# EAGLE design au-ar (EAGLE 9.5.1)

## Sheet 1 of 6: Au Connectors
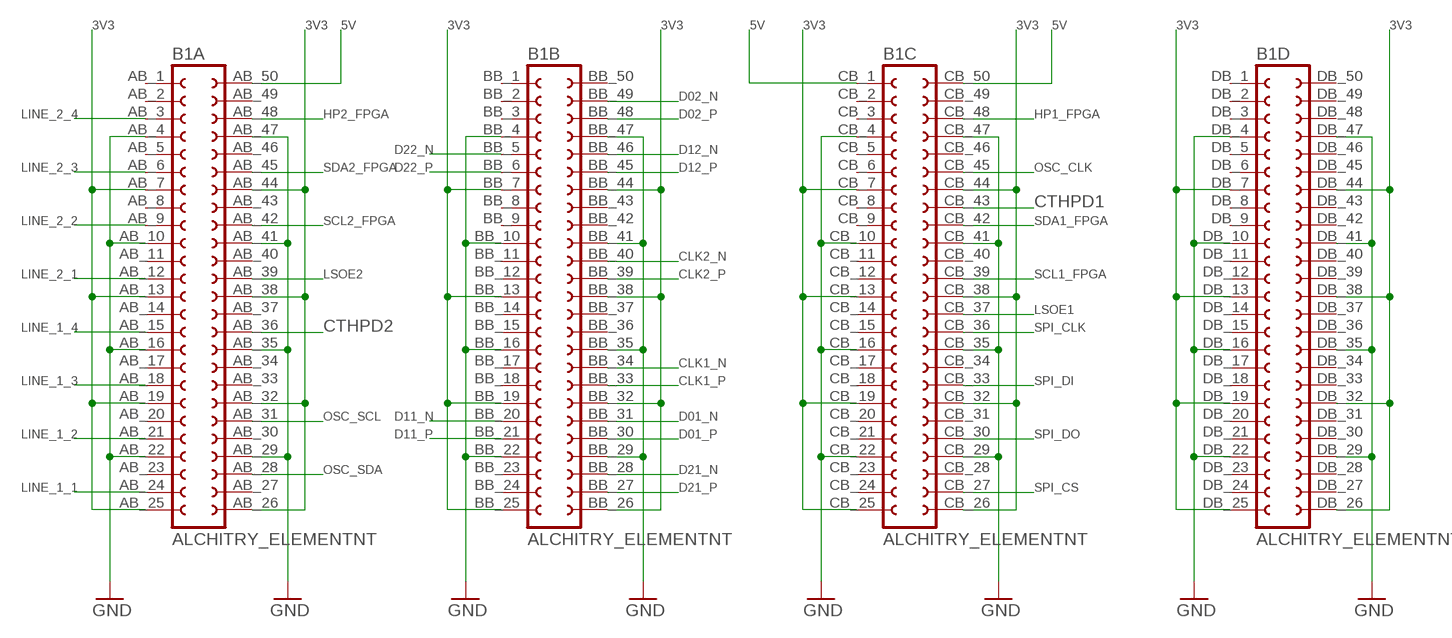
[diagram p0: schematic, sheet 1]

### Parts
B1  ALCHITRY_ELEMENTNT  [ELEMENT_NO_TOP]

### Nets
3V3: B1.AB_7 B1.AB_13 B1.AB_19 B1.AB_25 B1.AB_26 B1.AB_32 B1.AB_38 B1.AB_44 B1.BB_7 B1.BB_13 B1.BB_19 B1.BB_25 B1.BB_26 B1.BB_32 B1.BB_38 B1.BB_44 B1.CB_7 B1.CB_13 B1.CB_19 B1.CB_25 B1.CB_26 B1.CB_32 B1.CB_38 B1.CB_44 B1.DB_7 B1.DB_13 B1.DB_19 B1.DB_25 B1.DB_26 B1.DB_32 B1.DB_38 B1.DB_44 ; also sheet 3,4,5,6
5V: B1.AB_50 B1.CB_1 B1.CB_50 ; also sheet 3
CLK1_N [diff]: B1.BB_34 ; also sheet 2,3
CLK1_P [diff]: B1.BB_33 ; also sheet 2,3
CLK2_N [diff]: B1.BB_40 ; also sheet 2,3
CLK2_P [diff]: B1.BB_39 ; also sheet 2,3
CTHPD1: B1.CB_43 ; also sheet 3
CTHPD2: B1.AB_36 ; also sheet 3
D01_N [diff]: B1.BB_31 ; also sheet 2,3
D01_P [diff]: B1.BB_30 ; also sheet 2,3
D02_N [diff]: B1.BB_49 ; also sheet 2,3
D02_P [diff]: B1.BB_48 ; also sheet 2,3
D11_N [diff]: B1.BB_20 ; also sheet 2,3
D11_P [diff]: B1.BB_21 ; also sheet 2,3
D12_N [diff]: B1.BB_46 ; also sheet 2,3
D12_P [diff]: B1.BB_45 ; also sheet 2,3
D21_N [diff]: B1.BB_28 ; also sheet 2,3
D21_P [diff]: B1.BB_27 ; also sheet 2,3
D22_N [diff]: B1.BB_5 ; also sheet 2,3
D22_P [diff]: B1.BB_6 ; also sheet 2,3
GND: B1.AB_4 B1.AB_10 B1.AB_16 B1.AB_22 B1.AB_29 B1.AB_35 B1.AB_41 B1.AB_47 B1.BB_4 B1.BB_10 B1.BB_16 B1.BB_22 B1.BB_29 B1.BB_35 B1.BB_41 B1.BB_47 B1.CB_4 B1.CB_10 B1.CB_16 B1.CB_22 B1.CB_29 B1.CB_35 B1.CB_41 B1.CB_47 B1.DB_4 B1.DB_10 B1.DB_16 B1.DB_22 B1.DB_29 B1.DB_35 B1.DB_41 B1.DB_47 ; also sheet 2,3,4,5,6
HP1_FPGA: B1.CB_48 ; also sheet 3
HP2_FPGA: B1.AB_48 ; also sheet 3
LINE_1_1: B1.AB_24 ; also sheet 4
LINE_1_2: B1.AB_21 ; also sheet 4
LINE_1_3: B1.AB_18 ; also sheet 4
LINE_1_4: B1.AB_15 ; also sheet 4
LINE_2_1: B1.AB_12 ; also sheet 4
LINE_2_2: B1.AB_9 ; also sheet 4
LINE_2_3: B1.AB_6 ; also sheet 4
LINE_2_4: B1.AB_3 ; also sheet 4
LSOE1: B1.CB_37 ; also sheet 3
LSOE2: B1.AB_39 ; also sheet 3
OSC_CLK: B1.CB_45 ; also sheet 6
OSC_SCL: B1.AB_31 ; also sheet 6
OSC_SDA: B1.AB_28 ; also sheet 6
SCL1_FPGA: B1.CB_39 ; also sheet 3
SCL2_FPGA: B1.AB_42 ; also sheet 3
SDA1_FPGA: B1.CB_42 ; also sheet 3
SDA2_FPGA: B1.AB_45 ; also sheet 3
SPI_CLK: B1.CB_36 ; also sheet 5
SPI_CS: B1.CB_27 ; also sheet 5
SPI_DI: B1.CB_33 ; also sheet 5
SPI_DO: B1.CB_30 ; also sheet 5
Unconnected: B1.AB_1 B1.AB_2 B1.AB_5 B1.AB_8 B1.AB_11 B1.AB_14 B1.AB_17 B1.AB_20 B1.AB_23 B1.AB_27 B1.AB_30 B1.AB_33 B1.AB_34 B1.AB_37 B1.AB_40 B1.AB_43 B1.AB_46 B1.AB_49 B1.BB_1 B1.BB_2 B1.BB_3 B1.BB_8 B1.BB_9 B1.BB_11 B1.BB_12 B1.BB_14 B1.BB_15 B1.BB_17 B1.BB_18 B1.BB_23 B1.BB_24 B1.BB_36 B1.BB_37 B1.BB_42 B1.BB_43 B1.BB_50 B1.CB_2 B1.CB_3 B1.CB_5 B1.CB_6 B1.CB_8 B1.CB_9 B1.CB_11 B1.CB_12 B1.CB_14 B1.CB_15 B1.CB_17 B1.CB_18 B1.CB_20 B1.CB_21 B1.CB_23 B1.CB_24 B1.CB_28 B1.CB_31 B1.CB_34 B1.CB_40 B1.CB_46 B1.CB_49 B1.DB_1 B1.DB_2 B1.DB_3 B1.DB_5 B1.DB_6 B1.DB_8 B1.DB_9 B1.DB_11 B1.DB_12 B1.DB_14 B1.DB_15 B1.DB_17 B1.DB_18 B1.DB_20 B1.DB_21 B1.DB_23 B1.DB_24 B1.DB_27 B1.DB_28 B1.DB_30 B1.DB_31 B1.DB_33 B1.DB_34 B1.DB_36 B1.DB_37 B1.DB_39 B1.DB_40 B1.DB_42 B1.DB_43 B1.DB_45 B1.DB_46 B1.DB_48 B1.DB_49 B1.DB_50

## Sheet 2 of 6: HDMI Connectors
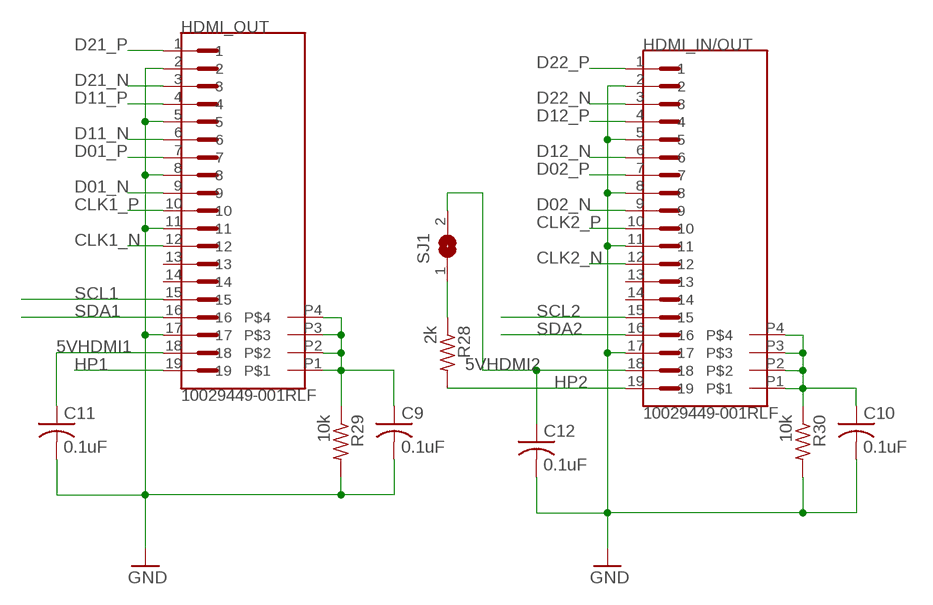
[diagram p1: schematic, sheet 2]

### Parts
C9  0.1uF  C-USC0603  [C0603]
C10  0.1uF  C-USC0603  [C0603]
C11  0.1uF  C-USC0603  [C0603]
C12  0.1uF  C-USC0603  [C0603]
HDMI_IN/OUT  10029449-001RLF  [FCI_10029449-001RLF]
HDMI_OUT  10029449-001RLF  [FCI_10029449-001RLF]
R28  2k  R-US_R0603  [R0603]
R29  10k  R-US_R0603  [R0603]
R30  10k  R-US_R0603  [R0603]
SJ1  SJ  [SJ]

### Nets
5VHDMI1: C11.1 HDMI_OUT.18 ; also sheet 3
5VHDMI2: C12.1 HDMI_IN/OUT.18 SJ1.2 ; also sheet 3
CLK1_N [diff]: HDMI_OUT.12 ; also sheet 1,3
CLK1_P [diff]: HDMI_OUT.10 ; also sheet 1,3
CLK2_N [diff]: HDMI_IN/OUT.12 ; also sheet 1,3
CLK2_P [diff]: HDMI_IN/OUT.10 ; also sheet 1,3
D01_N [diff]: HDMI_OUT.9 ; also sheet 1,3
D01_P [diff]: HDMI_OUT.7 ; also sheet 1,3
D02_N [diff]: HDMI_IN/OUT.9 ; also sheet 1,3
D02_P [diff]: HDMI_IN/OUT.7 ; also sheet 1,3
D11_N [diff]: HDMI_OUT.6 ; also sheet 1,3
D11_P [diff]: HDMI_OUT.4 ; also sheet 1,3
D12_N [diff]: HDMI_IN/OUT.6 ; also sheet 1,3
D12_P [diff]: HDMI_IN/OUT.4 ; also sheet 1,3
D21_N [diff]: HDMI_OUT.3 ; also sheet 1,3
D21_P [diff]: HDMI_OUT.1 ; also sheet 1,3
D22_N [diff]: HDMI_IN/OUT.3 ; also sheet 1,3
D22_P [diff]: HDMI_IN/OUT.1 ; also sheet 1,3
GND: C9.2 C10.2 C11.2 C12.2 HDMI_IN/OUT.2 HDMI_IN/OUT.5 HDMI_IN/OUT.8 HDMI_IN/OUT.11 HDMI_IN/OUT.17 HDMI_OUT.2 HDMI_OUT.5 HDMI_OUT.8 HDMI_OUT.11 HDMI_OUT.17 R29.2 R30.2 ; also sheet 1,3,4,5,6
HP1: HDMI_OUT.19 ; also sheet 3
HP2: HDMI_IN/OUT.19 R28.2 ; also sheet 3
N$2: R28.1 SJ1.1
N$13: C9.1 HDMI_OUT.P1 HDMI_OUT.P2 HDMI_OUT.P3 HDMI_OUT.P4 R29.1
N$14: C10.1 HDMI_IN/OUT.P1 HDMI_IN/OUT.P2 HDMI_IN/OUT.P3 HDMI_IN/OUT.P4 R30.1
SCL1: HDMI_OUT.15 ; also sheet 3
SCL2: HDMI_IN/OUT.15 ; also sheet 3
SDA1: HDMI_OUT.16 ; also sheet 3
SDA2: HDMI_IN/OUT.16 ; also sheet 3
Unconnected: HDMI_IN/OUT.13 HDMI_IN/OUT.14 HDMI_OUT.13 HDMI_OUT.14

## Sheet 3 of 6: HDMI Interfaces
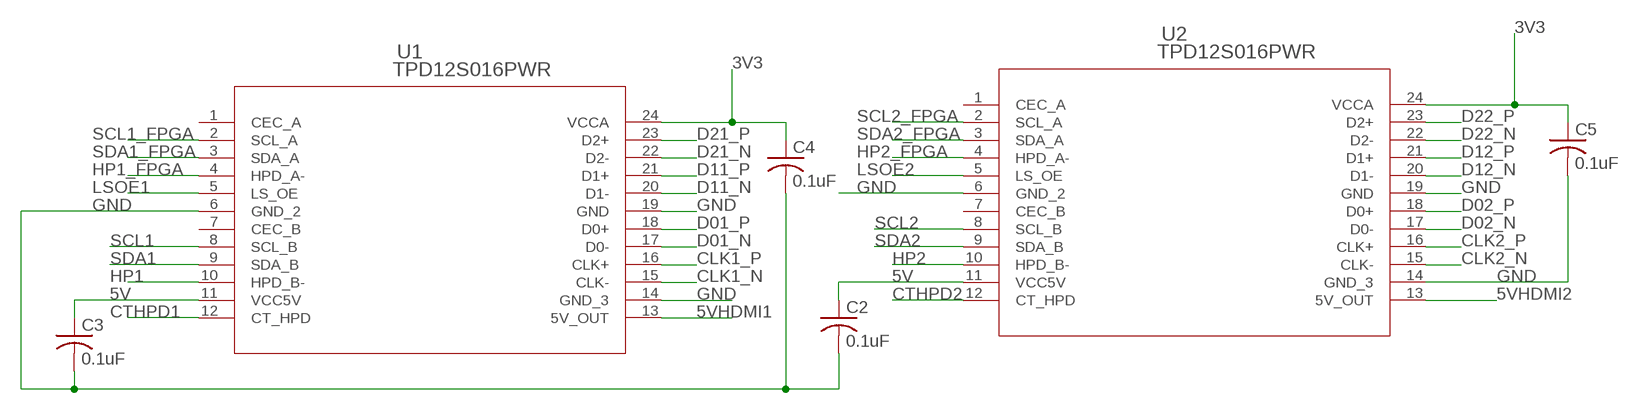
[diagram p2: schematic, sheet 3]

### Parts
C2  0.1uF  C-USC0603  [C0603]
C3  0.1uF  C-USC0603  [C0603]
C4  0.1uF  C-USC0603  [C0603]
C5  0.1uF  C-USC0603  [C0603]
U1  TPD12S016PWR  [PW24]
U2  TPD12S016PWR  [PW24]

### Nets
3V3: C4.1 C5.1 U1.24(VCCA) U2.24(VCCA) ; also sheet 1,4,5,6
5V: C2.1 C3.1 U1.11(VCC5V) U2.11(VCC5V) ; also sheet 1
5VHDMI1: U1.13(5V_OUT) ; also sheet 2
5VHDMI2: U2.13(5V_OUT) ; also sheet 2
CLK1_N [diff]: U1.15(CLK-) ; also sheet 1,2
CLK1_P [diff]: U1.16(CLK+) ; also sheet 1,2
CLK2_N [diff]: U2.15(CLK-) ; also sheet 1,2
CLK2_P [diff]: U2.16(CLK+) ; also sheet 1,2
CTHPD1: U1.12(CT_HPD) ; also sheet 1
CTHPD2: U2.12(CT_HPD) ; also sheet 1
D01_N [diff]: U1.17(D0-) ; also sheet 1,2
D01_P [diff]: U1.18(D0+) ; also sheet 1,2
D02_N [diff]: U2.17(D0-) ; also sheet 1,2
D02_P [diff]: U2.18(D0+) ; also sheet 1,2
D11_N [diff]: U1.20(D1-) ; also sheet 1,2
D11_P [diff]: U1.21(D1+) ; also sheet 1,2
D12_N [diff]: U2.20(D1-) ; also sheet 1,2
D12_P [diff]: U2.21(D1+) ; also sheet 1,2
D21_N [diff]: U1.22(D2-) ; also sheet 1,2
D21_P [diff]: U1.23(D2+) ; also sheet 1,2
D22_N [diff]: U2.22(D2-) ; also sheet 1,2
D22_P [diff]: U2.23(D2+) ; also sheet 1,2
GND: C2.2 C3.2 C4.2 C5.2 U1.6(GND_2) U1.14(GND_3) U1.19(GND) U2.6(GND_2) U2.14(GND_3) U2.19(GND) ; also sheet 1,2,4,5,6
HP1: U1.10(HPD_B-) ; also sheet 2
HP1_FPGA: U1.4(HPD_A-) ; also sheet 1
HP2: U2.10(HPD_B-) ; also sheet 2
HP2_FPGA: U2.4(HPD_A-) ; also sheet 1
LSOE1: U1.5(LS_OE) ; also sheet 1
LSOE2: U2.5(LS_OE) ; also sheet 1
SCL1: U1.8(SCL_B) ; also sheet 2
SCL1_FPGA: U1.2(SCL_A) ; also sheet 1
SCL2: U2.8(SCL_B) ; also sheet 2
SCL2_FPGA: U2.2(SCL_A) ; also sheet 1
SDA1: U1.9(SDA_B) ; also sheet 2
SDA1_FPGA: U1.3(SDA_A) ; also sheet 1
SDA2: U2.9(SDA_B) ; also sheet 2
SDA2_FPGA: U2.3(SDA_A) ; also sheet 1
Unconnected: U1.1(CEC_A) U1.7(CEC_B) U2.1(CEC_A) U2.7(CEC_B)

## Sheet 4 of 6: Camera Trigger Interface
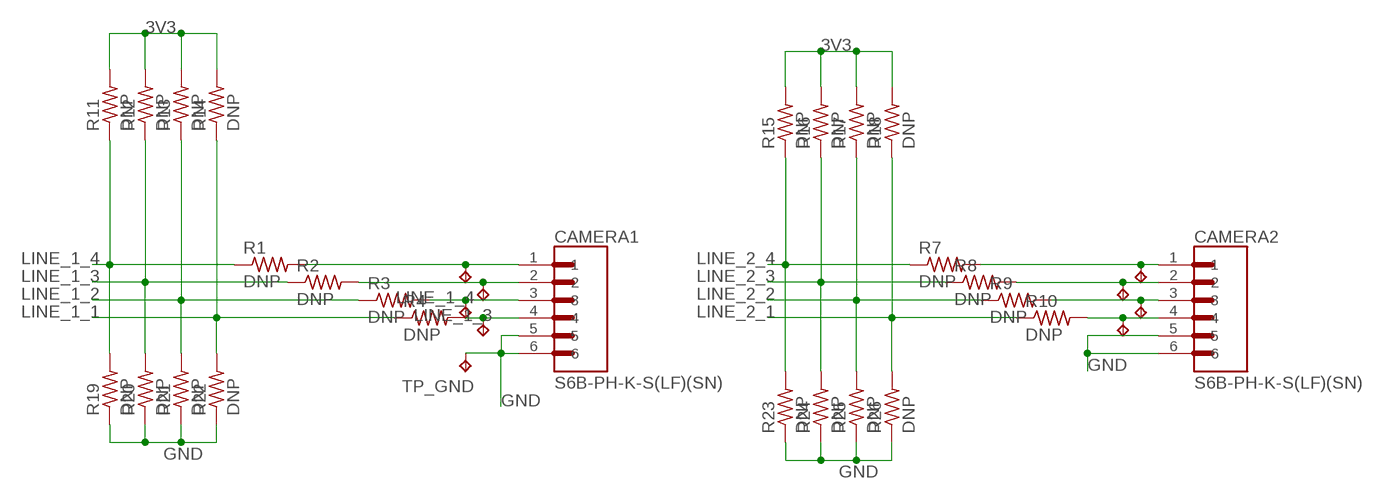
[diagram p3: schematic, sheet 4]

### Parts
1  LINE_1  TPTP16R  [TP16R]
2  LINE_2  TPTP16R  [TP16R]
3  LINE_3  TPTP16R  [TP16R]
4  LINE_1  TPTP16R  [TP16R]
CAMERA1  S6B-PH-K-S(LF)(SN)  [JST_S6B-PH-K-S(LF)(SN)]
CAMERA2  S6B-PH-K-S(LF)(SN)  [JST_S6B-PH-K-S(LF)(SN)]
LINE_1_1  TPTP16R  [TP16R]
LINE_1_2  TPTP16R  [TP16R]
LINE_1_3  TPTP16R  [TP16R]
LINE_1_4  TPTP16R  [TP16R]
R1  DNP  R-US_R0603  [R0603]
R2  DNP  R-US_R0603  [R0603]
R3  DNP  R-US_R0603  [R0603]
R4  DNP  R-US_R0603  [R0603]
R7  DNP  R-US_R0603  [R0603]
R8  DNP  R-US_R0603  [R0603]
R9  DNP  R-US_R0603  [R0603]
R10  DNP  R-US_R0603  [R0603]
R11  DNP  R-US_R0603  [R0603]
R12  DNP  R-US_R0603  [R0603]
R13  DNP  R-US_R0603  [R0603]
R14  DNP  R-US_R0603  [R0603]
R15  DNP  R-US_R0603  [R0603]
R16  DNP  R-US_R0603  [R0603]
R17  DNP  R-US_R0603  [R0603]
R18  DNP  R-US_R0603  [R0603]
R19  DNP  R-US_R0603  [R0603]
R20  DNP  R-US_R0603  [R0603]
R21  DNP  R-US_R0603  [R0603]
R22  DNP  R-US_R0603  [R0603]
R23  DNP  R-US_R0603  [R0603]
R24  DNP  R-US_R0603  [R0603]
R25  DNP  R-US_R0603  [R0603]
R26  DNP  R-US_R0603  [R0603]
TP_GND  TPTP16R  [TP16R]

### Nets
3V3: R11.2 R12.2 R13.2 R14.2 R15.2 R16.2 R17.2 R18.2 ; also sheet 1,3,5,6
GND: CAMERA1.5 CAMERA1.6 CAMERA2.5 CAMERA2.6 R19.1 R20.1 R21.1 R22.1 R23.1 R24.1 R25.1 R26.1 TP_GND.TP ; also sheet 1,2,3,5,6
LINE_1_1: R4.1 R14.1 R22.2 ; also sheet 1
LINE_1_2: R3.1 R13.1 R21.2 ; also sheet 1
LINE_1_3: R2.1 R12.1 R20.2 ; also sheet 1
LINE_1_4: R1.1 R11.1 R19.2 ; also sheet 1
LINE_2_1: R10.1 R18.1 R26.2 ; also sheet 1
LINE_2_2: R9.1 R17.1 R25.2 ; also sheet 1
LINE_2_3: R8.1 R16.1 R24.2 ; also sheet 1
LINE_2_4: R7.1 R15.1 R23.2 ; also sheet 1
N$3: 4.TP CAMERA2.1 R7.2
N$4: 3.TP CAMERA2.2 R8.2
N$5: 2.TP CAMERA2.3 R9.2
N$6: 1.TP CAMERA2.4 R10.2
N$7: CAMERA1.1 LINE_1_4.TP R1.2
N$8: CAMERA1.2 LINE_1_3.TP R2.2
N$9: CAMERA1.3 LINE_1_2.TP R3.2
N$10: CAMERA1.4 LINE_1_1.TP R4.2

## Sheet 5 of 6: SPI Flash Memory
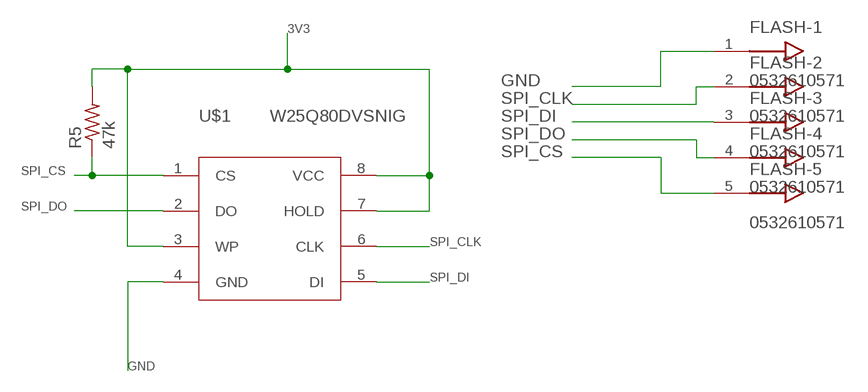
[diagram p4: schematic, sheet 5]

### Parts
FLASH  0532610571  [PICOBLADE53261-0571]
R5  47k  R-US_R0603  [R0603]
U$1  W25Q80DVSNIG  [SOIC8]

### Nets
3V3: R5.2 U$1.3(WP) U$1.7(HOLD) U$1.8(VCC) ; also sheet 1,3,4,6
GND: FLASH.1 U$1.4(GND) ; also sheet 1,2,3,4,6
SPI_CLK: FLASH.2 U$1.6(CLK) ; also sheet 1
SPI_CS: FLASH.5 R5.1 U$1.1(CS) ; also sheet 1
SPI_DI: FLASH.3 U$1.5(DI) ; also sheet 1
SPI_DO: FLASH.4 U$1.2(DO) ; also sheet 1

## Sheet 6 of 6: Programmable Oscillator
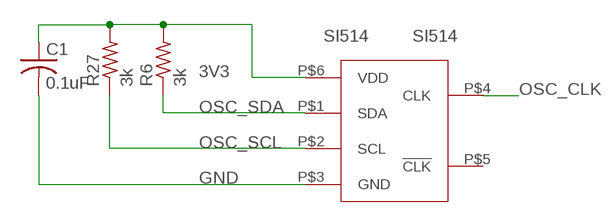
[diagram p5: schematic, sheet 6]

### Parts
C1  0.1uF  C-USC0603  [C0603]
R6  3k  R-US_R0603  [R0603]
R27  3k  R-US_R0603  [R0603]
SI514  SI514  [XTAL-6PIN]

### Nets
3V3: C1.1 R6.2 R27.2 SI514.P$6(VDD) ; also sheet 1,3,4,5
GND: C1.2 SI514.P$3(GND) ; also sheet 1,2,3,4,5
OSC_CLK: SI514.P$4(CLK) ; also sheet 1
OSC_SCL: R27.1 SI514.P$2(SCL) ; also sheet 1
OSC_SDA: R6.1 SI514.P$1(SDA) ; also sheet 1
Unconnected: SI514.P$5(!CLK)

## Library data of the parts
1-4 LINE_1_1-LINE_1_4 TP_GND = testpad:TP: Test pad
B1 = alchitry_elements:ALCHITRY_ELEMENT
C1-C5 C9-C12 = rcl:C-US: CAPACITOR, American symbol; SPICEPREFIX: C
CAMERA1 CAMERA2 = S6B-PH-K-S_LF__SN_:S6B-PH-K-S(LF)(SN): PH Series 6 Position 2 mm Pitch Through Hole Side Entry Shrouded Header; DESCRIPTION: PH Series 6 Position 2 mm Pitch Through Hole Side Entry Shrouded Header; DIGI-KEY_PART_NUMBER: 455-1723-ND; DIGI-KEY_PURCHASE_URL: https://www.digikey.com/product-detail/en/jst-sales-america-inc/S6B-PH-K-S_LF__SN_/455-1723-ND/926630?utm_source=snapeda&utm_medium=aggregator&utm_campaign=symbol; MF: JST Sales; MP: S6B-PH-K-S_LF__SN_; PACKAGE: None
FLASH = volks73-Molex:0532610571: 1.25mm Pitch PicoBlade™ Header, Surface Mount, Right Angle, 5 Circuits PicoBlade™ Connector System Documentation Drawing <http://www.molex.com/pdm_docs/sd/532610571_sd.pdf>; CATEGORY: Connectors, Interconnects; COLOR: Natural; CONNECTOR_TYPE: Header, Shrouded; CONTACT_FINISH: Tin; CONTACT_FINISH_THICKNESS: 39µin (1.00µm); CONTACT_MATING_LENGTH: -; CONTACT_TYPE: Blade Pin; DESCRIPTION: CONN HEADER 5POS 1.25MM R/A SMD; DOCUMENTATION_LINK: <a href="http://www.molex.com/pdm_docs/sd/532610571_sd.pdf">Datasheet</a>; DOCUMENTATION_URL: http://www.molex.com/pdm_docs/sd/532610571_sd.pdf; FAMILY: Rectangular Connectors - Headers, Male Pins; FASTENING_TYPE: -; FEATURES: Solder Retention; MANUFACTURER: Molex Inc; MOUNTING_TYPE: Surface Mount, Right Angle; NUMBER_OF_POSITIONS: 5; NUMBER_OF_POSITIONS_LOADED: All; NUMBER_OF_ROWS: 1; PART_NUMBER: 0532610571; PITCH: 0.049" (1.25mm); ROW_SPACING: -; SERIES: PicoBlade™ 53261; SUPPLIER_ITEM_LINK: <a href="http://www.digikey.com/product-detail/en/0532610571/WM7623CT-ND/699110">Details</a>; SUPPLIER_ITEM_NUMBER: WM7623CT-ND; SUPPLIER_ITEM_URL: http://www.digikey.com/product-detail/en/0532610571/WM7623CT-ND/699110; SUPPLIER_LINK: <a href="http://www.digikey.com">Home Page</a>; SUPPLIER_NAME: Digi-Key; SUPPLIER_URL: http://www.digikey.com; TERMINATION: Solder
HDMI_IN/OUT HDMI_OUT = 10029449-001RLF:10029449-001RLF: Conn; Data; HDMI; Jack; TypeA; 90Deg; PartialSMT(ThruHoleForShellPeg); 19Cnts; w/oFlange; AVAILABILITY: Unavailable; DESCRIPTION: Connectors, Connectors and Adapters; MF: Amphenol FCI; MP: 10029449-001RLF; PACKAGE: None; PRICE: None
R1-R30 = rcl:R-US_: RESISTOR, American symbol; SPICEPREFIX: R
SI514 = lupa300-components:SI514
SJ1 = jumper:SJ: SMD solder JUMPER
U1 U2 = lupa300-components:TPD12S016PWR; MANUFACTURER_PART_NUMBER: TPD12S016PWR; VENDOR: Texas Instruments
U$1 = TDP12S521:W25Q80DVSNIG: FLASH - NOR Memory IC 8Mb (1M x 8) SPI 104MHz 8-SOIC

## Net classes
1 diff: width 0.203 mm, clearance 0.203 mm to class 0, clearance 0.203 mm

## Board
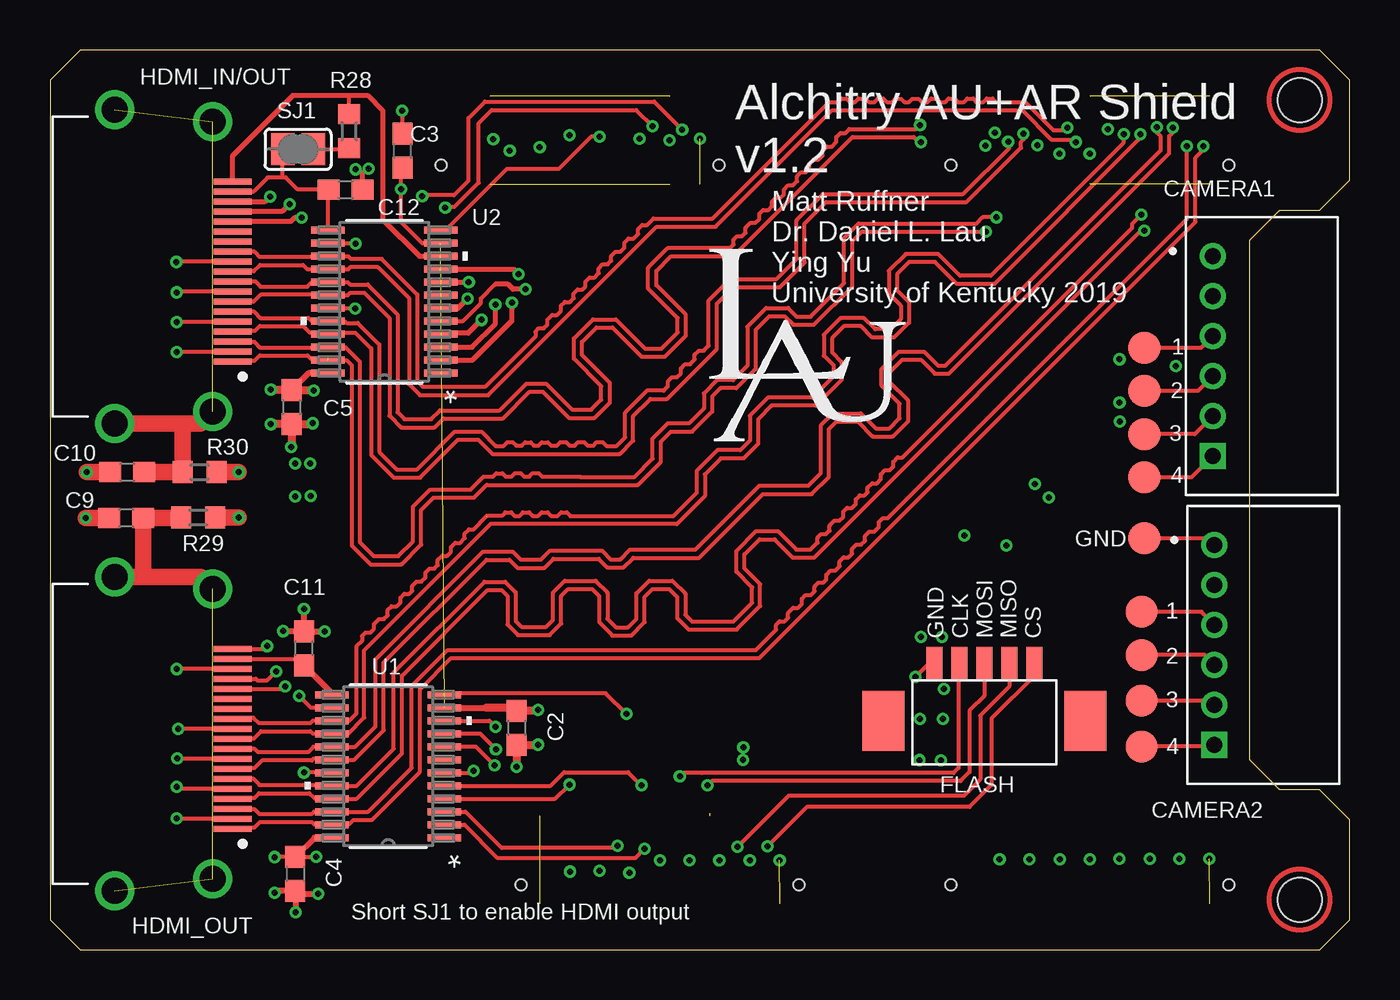
[diagram p6: board, top side]
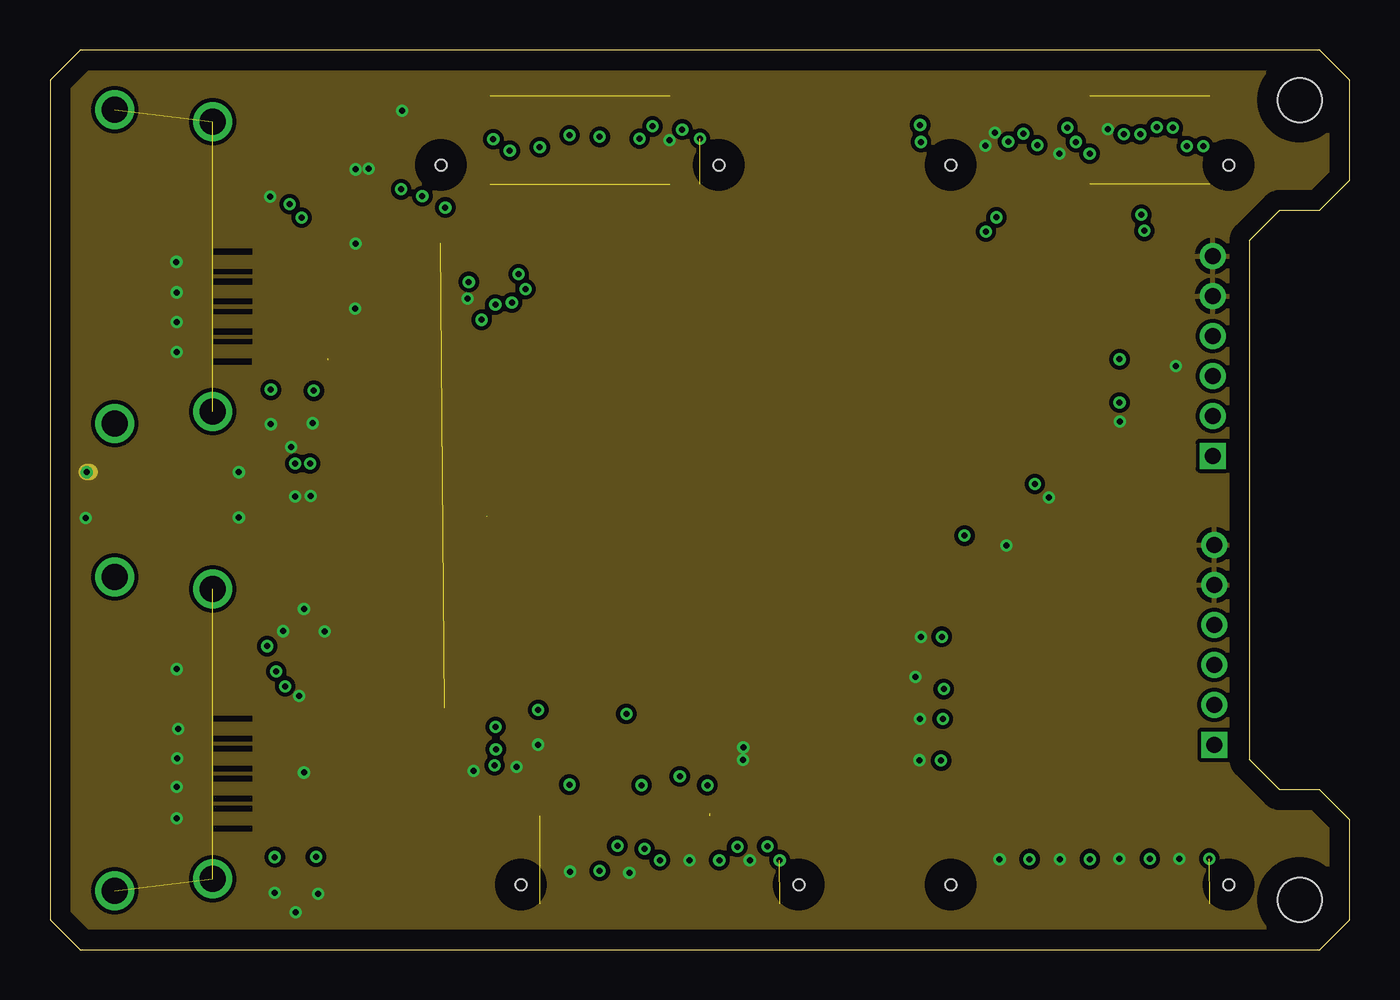
[diagram p7: board, inner layer Route2]
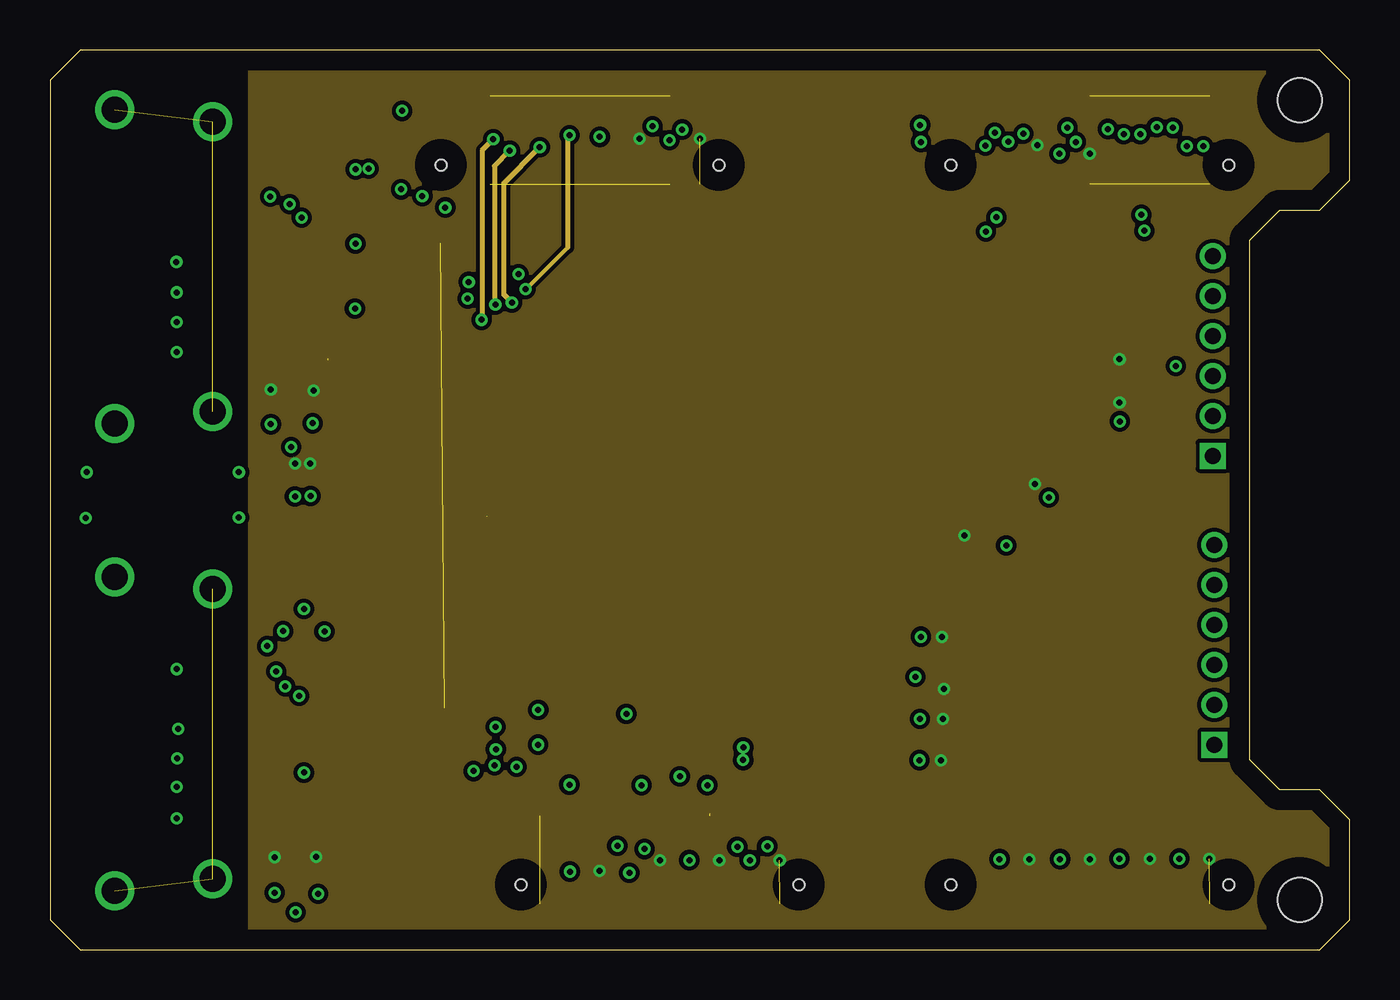
[diagram p8: board, inner layer Route15]
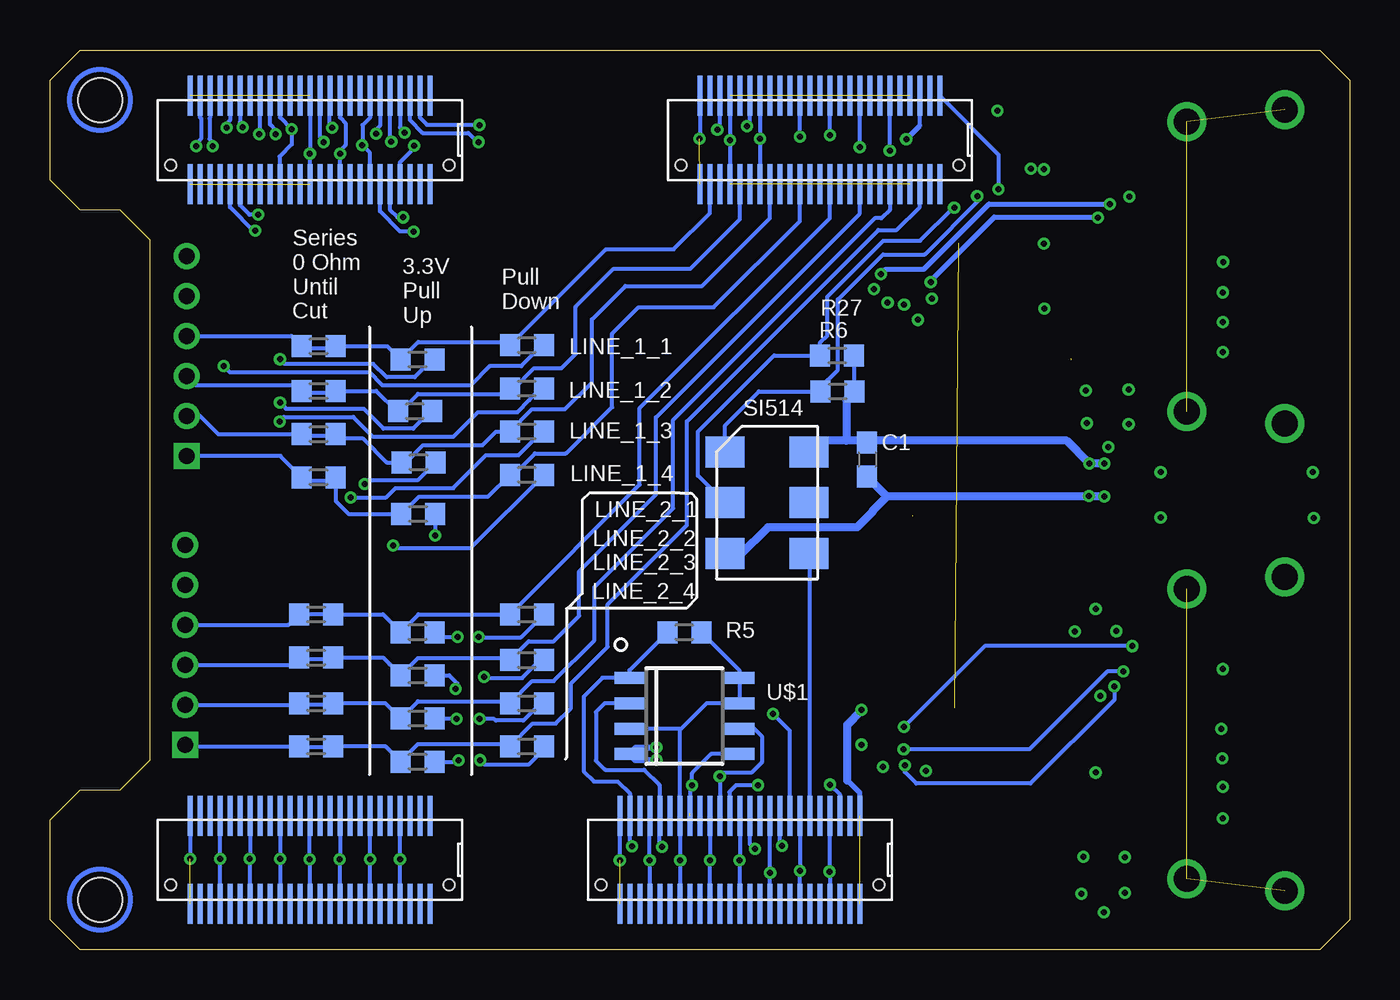
[diagram p9: board, bottom side, seen from below]

Size 65 x 45 mm. Coordinates in mm from the lower left corner, seen from the top.
Copper layers (1+2*15+16): Top 0.035mm / dielectric 0.175mm / Route2 0.035mm / dielectric 0.53mm / Route15 0.035mm / dielectric 0.175mm / Bottom 0.035mm
Design rules "default *": minimum track width 6mil, minimum drill 0.35mm, track to track 8mil, track to pad 8mil, pad to pad 8mil, via to via 8mil, smd to smd 8mil, copper to edge 40mil, drill to drill 6mil, minimum pad ring 10mil, minimum via ring 6mil, stop-mask expansion 4mil, vias tented up to drill 12mil, thermal gap 10mil

### Footprints (pad centres in the part's own frame; a part is rotated, then mirrored left to right if it is on the bottom)
TP16R = smd 1.6 x 1.6: TP 0,0
ELEMENT_NO_TOP = smd 0.25 x 2 bottom: AB_1 20.5,38.3; AB_2 21,38.3; AB_3 21.5,38.3; AB_4 22,38.3; AB_5 22.5,38.3; AB_6 23,38.3; AB_7 23.5,38.3; AB_8 24,38.3; AB_9 24.5,38.3; AB_10 25,38.3; AB_11 25.5,38.3; AB_12 26,38.3; AB_13 26.5,38.3; AB_14 27,38.3; AB_15 27.5,38.3; AB_16 28,38.3; AB_17 28.5,38.3; AB_18 29,38.3; AB_19 29.5,38.3; AB_20 30,38.3; AB_21 30.5,38.3; AB_22 31,38.3; AB_23 31.5,38.3; AB_24 32,38.3; AB_25 32.5,38.3; AB_26 32.5,42.7; AB_27 32,42.7; AB_28 31.5,42.7; AB_29 31,42.7; AB_30 30.5,42.7; AB_31 30,42.7; AB_32 29.5,42.7; AB_33 29,42.7; AB_34 28.5,42.7; AB_35 28,42.7; AB_36 27.5,42.7; AB_37 27,42.7; AB_38 26.5,42.7; AB_39 26,42.7; AB_40 25.5,42.7; AB_41 25,42.7; AB_42 24.5,42.7; AB_43 24,42.7; AB_44 23.5,42.7; AB_45 23,42.7; AB_46 22.5,42.7; AB_47 22,42.7; AB_48 21.5,42.7; AB_49 21,42.7; AB_50 20.5,42.7; BB_1 46,38.3; BB_2 46.5,38.3; BB_3 47,38.3; BB_4 47.5,38.3; BB_5 48,38.3; BB_6 48.5,38.3; BB_7 49,38.3; BB_8 49.5,38.3; BB_9 50,38.3; BB_10 50.5,38.3; BB_11 51,38.3; BB_12 51.5,38.3; BB_13 52,38.3; BB_14 52.5,38.3; BB_15 53,38.3; BB_16 53.5,38.3; BB_17 54,38.3; BB_18 54.5,38.3; BB_19 55,38.3; BB_20 55.5,38.3; BB_21 56,38.3; BB_22 56.5,38.3; BB_23 57,38.3; BB_24 57.5,38.3; BB_25 58,38.3; BB_26 58,42.7; BB_27 57.5,42.7; BB_28 57,42.7; BB_29 56.5,42.7; BB_30 56,42.7; BB_31 55.5,42.7; BB_32 55,42.7; BB_33 54.5,42.7; BB_34 54,42.7; BB_35 53.5,42.7; BB_36 53,42.7; BB_37 52.5,42.7; BB_38 52,42.7; BB_39 51.5,42.7; BB_40 51,42.7; BB_41 50.5,42.7; BB_42 50,42.7; BB_43 49.5,42.7; BB_44 49,42.7; BB_45 48.5,42.7; BB_46 48,42.7; BB_47 47.5,42.7; BB_48 47,42.7; BB_49 46.5,42.7; BB_50 46,42.7; CB_1 24.5,2.3; CB_2 25,2.3; CB_3 25.5,2.3; CB_4 26,2.3; CB_5 26.5,2.3; CB_6 27,2.3; CB_7 27.5,2.3; CB_8 28,2.3; CB_9 28.5,2.3; CB_10 29,2.3; CB_11 29.5,2.3; CB_12 30,2.3; CB_13 30.5,2.3; CB_14 31,2.3; CB_15 31.5,2.3; CB_16 32,2.3; CB_17 32.5,2.3; CB_18 33,2.3; CB_19 33.5,2.3; CB_20 34,2.3; CB_21 34.5,2.3; CB_22 35,2.3; CB_23 35.5,2.3; CB_24 36,2.3; CB_25 36.5,2.3; CB_26 36.5,6.7; CB_27 36,6.7; CB_28 35.5,6.7; CB_29 35,6.7; CB_30 34.5,6.7; CB_31 34,6.7; CB_32 33.5,6.7; CB_33 33,6.7; CB_34 32.5,6.7; CB_35 32,6.7; CB_36 31.5,6.7; CB_37 31,6.7; CB_38 30.5,6.7; CB_39 30,6.7; CB_40 29.5,6.7; CB_41 29,6.7; CB_42 28.5,6.7; CB_43 28,6.7; CB_44 27.5,6.7; CB_45 27,6.7; CB_46 26.5,6.7; CB_47 26,6.7; CB_48 25.5,6.7; CB_49 25,6.7; CB_50 24.5,6.7; DB_1 46,2.3; DB_2 46.5,2.3; DB_3 47,2.3; DB_4 47.5,2.3; DB_5 48,2.3; DB_6 48.5,2.3; DB_7 49,2.3; DB_8 49.5,2.3; DB_9 50,2.3; DB_10 50.5,2.3; DB_11 51,2.3; DB_12 51.5,2.3; DB_13 52,2.3; DB_14 52.5,2.3; DB_15 53,2.3; DB_16 53.5,2.3; DB_17 54,2.3; DB_18 54.5,2.3; DB_19 55,2.3; DB_20 55.5,2.3; DB_21 56,2.3; DB_22 56.5,2.3; DB_23 57,2.3; DB_24 57.5,2.3; DB_25 58,2.3; DB_26 58,6.7; DB_27 57.5,6.7; DB_28 57,6.7; DB_29 56.5,6.7; DB_30 56,6.7; DB_31 55.5,6.7; DB_32 55,6.7; DB_33 54.5,6.7; DB_34 54,6.7; DB_35 53.5,6.7; DB_36 53,6.7; DB_37 52.5,6.7; DB_38 52,6.7; DB_39 51.5,6.7; DB_40 51,6.7; DB_41 50.5,6.7; DB_42 50,6.7; DB_43 49.5,6.7; DB_44 49,6.7; DB_45 48.5,6.7; DB_46 48,6.7; DB_47 47.5,6.7; DB_48 47,6.7; DB_49 46.5,6.7; DB_50 46,6.7 | hole 2.2: 62.5,42.5; 62.5,2.5 | hole 0.55: 58.95,39.25; 45.05,39.25; 33.45,39.25; 19.55,39.25; 58.95,3.25; 45.05,3.25; 37.45,3.25; 23.55,3.25
C0603 = smd 1.1 x 1: 1 -0.85,0; 2 0.85,0
JST_S6B-PH-K-S(LF)(SN) = drill 0.8 square: 1 -5,0 | drill 0.8: 2 -3,0; 3 -1,0; 4 1,0; 5 3,0; 6 5,0
PICOBLADE53261-0571 = smd 0.8 x 1.6: 1 -2.4,2.4; 2 -1.15,2.4; 3 0.1,2.4; 4 1.35,2.4; 5 2.6,2.4 | smd 2.1 x 3: GND@1 -4.95,-0.5; GND@2 5.15,-0.5
FCI_10029449-001RLF = smd 0.3 x 1.9: 1 4.75,0; 2 4.25,0; 3 3.75,0; 4 3.25,0; 5 2.75,0; 6 2.25,0; 7 1.75,0; 8 1.25,0; 9 0.75,0; 10 0.25,0; 11 -0.25,0; 12 -0.75,0; 13 -1.25,0; 14 -1.75,0; 15 -2.25,0; 16 -2.75,0; 17 -3.25,0; 18 -3.75,0; 19 -4.25,0 | drill 1.3: P1 7.25,-1; P2 -7.25,-1; P3 -7.85,-5.9; P4 7.85,-5.9
R0603 = smd 1 x 1.1: 1 -0.85,0; 2 0.85,0
XTAL-6PIN = smd 1.95 x 1.55: P$1 -2.1,2.54; P$2 -2.1,0; P$3 -2.1,-2.54; P$4 2.1,-2.54; P$5 2.1,0; P$6 2.1,2.54
SJ = smd 1.168 x 1.6: 1 -0.762,0; 2 0.762,0
PW24 = smd 1.676 x 0.356: 1 -2.819,3.575; 2 -2.819,2.925; 3 -2.819,2.275; 4 -2.819,1.625; 5 -2.819,0.975; 6 -2.819,0.325; 7 -2.819,-0.325; 8 -2.819,-0.975; 9 -2.819,-1.625; 10 -2.819,-2.275; 11 -2.819,-2.925; 12 -2.819,-3.575; 13 2.819,-3.575; 14 2.819,-2.925; 15 2.819,-2.275; 16 2.819,-1.625; 17 2.819,-0.975; 18 2.819,-0.325; 19 2.819,0.325; 20 2.819,0.975; 21 2.819,1.625; 22 2.819,2.275; 23 2.819,2.925; 24 2.819,3.575
SOIC8 = smd 0.6 x 1.5: 1 -1.905,-2.75; 2 -0.635,-2.75; 3 0.635,-2.75; 4 1.905,-2.75; 5 1.905,2.75; 6 0.635,2.75; 7 -0.635,2.75; 8 -1.905,2.75

### Placement (x,y rotation side)
1  54.61,16.89 0 top
2  54.61,14.73 0 top
3  54.61,12.45 0 top
4  54.61,10.16 0 top
B1  0,0 0 top
C1  24.13,24.51 270 bottom
C2  23.34,11.09 270 top
C3  17.65,39.95 90 top
C4  12.27,3.78 270 top
C5  12.08,27.13 270 top
C9  3.81,21.59 180 top
C10  3.86,23.88 180 top
C11  12.71,15.07 90 top
C12  14.78,38.02 0 top
CAMERA1  58.17,29.69 90 top
CAMERA2  58.24,15.24 90 top
FLASH  46.63,11.94 0 top
HDMI_IN/OUT  9.14,34.16 270 top
HDMI_OUT  9.14,10.79 270 top
LINE_1_1  54.74,30.1 0 top
LINE_1_2  54.74,27.94 0 top
LINE_1_3  54.74,25.78 0 top
LINE_1_4  54.74,23.62 0 top
R1  51.56,23.62 180 bottom
R2  51.56,25.78 180 bottom
R3  51.56,27.94 180 bottom
R4  51.57,30.18 180 bottom
R5  33.27,15.88 0 bottom
R6  25.6,27.91 0 bottom
R7  51.69,10.16 180 bottom
R8  51.69,12.32 180 bottom
R9  51.69,14.61 180 bottom
R10  51.69,16.76 180 bottom
R11  46.58,21.79 0 bottom
R12  46.56,24.37 0 bottom
R13  46.75,26.93 0 bottom
R14  46.61,29.51 0 bottom
R15  46.61,9.4 0 bottom
R16  46.61,11.56 0 bottom
R17  46.61,13.72 0 bottom
R18  46.61,15.88 0 bottom
R19  41.15,23.75 180 bottom
R20  41.15,25.91 180 bottom
R21  41.15,28.07 180 bottom
R22  41.15,30.23 180 bottom
R23  41.15,10.16 180 bottom
R24  41.15,12.32 180 bottom
R25  41.15,14.48 180 bottom
R26  41.15,16.76 180 bottom
R27  25.63,29.72 0 bottom
R28  14.96,40.93 90 top
R29  7.42,21.62 0 top
R30  7.49,23.88 0 top
SI514  29.13,22.35 0 bottom
SJ1  12.41,40.03 180 top
TP_GND  54.74,20.57 0 top
U1  16.92,9.17 180 top
U2  16.73,32.41 180 top
U$1  33.27,11.68 270 bottom

### Tracks (layer width: path | path; a pad name or v marks a point on that pad's centre or on a via)
3V3  (via drill 0.3)  (11 unrouted)
  Top 0.203: v13.3,4.64 v13.3,4.63 C4.1 11.26,4.63 v11.25,4.62
  Top 0.305: U2.24 12.94,28.84 C5.1 | U1.24 13.23,5.59 C4.1
  Top 0.406: v11.05,28 11.07,27.98 C5.1 13.17,27.98 v13.2,27.95
  Bottom 0.203: R14.2 45.88,29.51 46.76,28.63 48.16,28.63 48.83,29.3 53.27,29.3 v53.5,29.53 | R13.2 45.96,26.93 46.83,26.06 48.32,26.06 49.32,27.06 53.19,27.06 v53.5,27.36 | v49.26,23.29 49.05,23.5 46.58,23.5 R12.2 | R11.2 45.73,20.72 v45.74,20.7 | R18.2 45.53,15.65 v44.6,15.65 | R17.2 45.03,13.72 44.63,13.32 44.63,13.1 v44.7,13.03 | R16.2 44.68,11.56 v44.65,11.53 | R15.2 44.63,9.4 v44.57,9.46 | R5.2 30.52,13.97 U$1.8 U$1.7 32.16,12.32 33.43,11.05 | 33.43,11.05 U$1.3 | 33.43,11.05 33.5,10.97 B1.CB_32 33.5,4.49 v33.48,4.47 33.48,2.32 B1.CB_19 | B1.CB_7 v27.5,3.94 B1.CB_44 | B1.CB_13 v30.5,4.46 v30.5,4.47 v30.5,4.48 B1.CB_38 | v36.5,4.47 B1.CB_26 | B1.CB_26 | B1.BB_38 v52,39.81 | v52,39.81 | B1.BB_13 v52.01,39.8 v52,39.81 | B1.DB_7 v49,4.52 B1.DB_44 | B1.DB_13 52,4.5 v52.02,4.52 52.02,6.68 B1.DB_38 | B1.DB_32 55,4.56 v55.02,4.55 55.02,2.32 B1.DB_19 | B1.DB_26 v58,4.56 v57.99,4.55 | B1.BB_44 49,41.61 49.37,41.24 49.37,40.24 v49.38,40.23 49,39.86 B1.BB_7 | B1.AB_32 29.5,40.57 v29.49,40.56 v29.5,40.55 B1.AB_19 | B1.AB_26 32.5,40.58 v32.51,40.56 | 24.75,29.74 R27.2 | R6.2 24.75,29.74 | 24.75,29.74 24.69,29.81
  Bottom 0.406: 24.78,27.94 R6.2 25.17,27.5 25.17,25.45 | C1.1 24.22,25.45 | 24.22,25.45 25.17,25.45 | v12.27,24.31 v13.01,24.31 14.15,25.45 24.22,25.45 | 25.17,25.45 26.48,25.45 SI514.P$6
  pour Route15 (isolate 0.203): 10.26,46.46 9.98,46.18 9.98,-0.79 63.6,-0.79 65.76,1.37 65.76,43.66 62.84,46.58 10.26,46.58
5V  (via drill 0.3)  (2 unrouted)
  Top 0.203: U2.11 19.54,35.33 18.61,35.33 17.56,36.38 v17.56,38.03 17.56,39.02 C3.1
  Top 0.305: U1.11 21.83,12.09 | 23.18,12.09 C2.1
  Top 0.406: 23.18,12.09 21.83,12.09 | v24.42,11.98 24.38,11.94 C2.1
  Bottom 0.203: B1.AB_50 17.56,39.76 v17.56,38.03
  Bottom 0.254: B1.CB_50 24.5,7.84 25.12,8.46
  Bottom 0.406: v24.42,11.98 24.4,11.96 25.12,11.25 25.12,8.46
5VHDMI1
  Top 0.203: HDMI_OUT.18 12.39,14.54
  Top 0.305: U1.13 14.1,12.84 C11.1 12.39,14.54
5VHDMI2
  Top 0.203: 11.6,38.61 11.8,38.61 12.39,38.02 C12.1 13.91,37.99 U2.13 | 11.6,38.61 10.88,38.61 10.18,37.91 HDMI_IN/OUT.18 | 11.6,38.61 11.65,38.66 SJ1.2
  Top 0.305: U2.13
CLK1_N  (via drill 0.3)  (1 unrouted)
  Top 0.203: HDMI_OUT.12 9.2,11.6 10.17,11.6 10.44,11.33 13.03,11.33 13.15,11.44 U1.15 14.96,11.44 15.32,11.8 15.32,15.15 15.61,15.44 15.61,15.68 15.78,15.86 16.03,15.86 16.21,16.04 16.21,16.28 16.45,16.53 16.7,16.53 16.89,16.72 16.89,16.98 17.08,17.17 17.34,17.17 17.53,17.36 17.53,17.6 17.72,17.79 17.96,17.79 18.12,17.95 18.12,18.19 18.33,18.4 18.57,18.4 18.78,18.61 18.78,18.85 18.98,19.06 19.22,19.06 19.4,19.24 19.4,19.48 19.61,19.69 19.86,19.69 20.06,19.89 20.06,20.14 20.27,20.34 20.52,20.34 20.75,20.58 20.75,20.82 20.95,21.02 21.2,21.02 21.85,21.68 | v53.7,40.78 53.68,40.76 53.68,40.33 47.06,33.71 45.52,33.71 44.43,34.8 42.8,34.8 41.96,33.95 41.96,32.82 42.56,32.23 42.56,31.53 42.05,31.03 41.28,31.03 40.72,31.59 39.54,31.59 38.71,30.75 38.71,29.71 39.19,29.23 39.19,28.66 38.14,27.61 35.91,27.61 35.01,26.71 35.01,25.46 34.53,24.98 33.39,24.98 32.35,23.94 32.35,22.85 31.18,21.68 26.03,21.68 25.85,21.86 25.57,21.86 25.39,21.69 25.06,21.69 24.89,21.86 24.59,21.86 24.42,21.69 24.14,21.69 23.96,21.86 23.66,21.86 23.49,21.7 23.24,21.7 23.07,21.86 22.78,21.86 22.6,21.69 21.86,21.69
  Bottom 0.203: 53.98,42.67 B1.BB_34 54,41.28 53.7,40.99 v53.7,40.78
CLK1_P  (via drill 0.3)
  Top 0.203: HDMI_OUT.10 10.18,10.54 10.56,10.92 13.03,10.92 13.16,10.79 U1.16 14.91,10.79 15.72,11.61 15.72,14.97 22.03,21.28 31.35,21.28 32.75,22.68 32.75,23.77 33.56,24.57 34.7,24.57 35.41,25.29 35.41,26.52 36.1,27.2 38.31,27.2 39.6,28.49 39.6,29.4 39.12,29.88 39.12,30.59 39.71,31.18 40.56,31.18 41.12,30.62 42.22,30.62 42.96,31.36 42.96,32.39 42.37,32.99 42.37,33.79 42.97,34.39 44.26,34.39 45.36,33.3 47.23,33.3 54.53,40.61 v54.53,40.78 v54.53,40.79
  Bottom 0.203: v54.53,40.79 54.51,40.8 B1.BB_33
CLK2_N  (via drill 0.3)
  Top 0.203: HDMI_IN/OUT.12 10.23,34.91 10.49,34.65 13.87,34.65 U2.15 14.92,34.69 15.06,34.55 16.59,34.55 18.36,32.77 18.36,28.45 18.67,28.14 21.76,28.14 24.28,30.66 24.28,30.91 24.45,31.08 24.69,31.08 24.88,31.26 24.88,31.5 25.12,31.75 25.37,31.75 25.56,31.94 25.56,32.2 25.75,32.39 26.01,32.39 26.2,32.58 26.2,32.82 26.39,33.01 26.63,33.01 26.78,33.17 26.78,33.41 27,33.62 27.24,33.62 27.44,33.83 27.44,34.07 27.65,34.28 27.89,34.28 28.07,34.46 28.07,34.7 28.28,34.91 28.53,34.91 28.73,35.11 28.73,35.36 28.94,35.57 29.18,35.57 29.42,35.8 29.42,36.04 29.62,36.25 29.86,36.25 30.18,36.56 33.13,36.56 38.95,42.39 39.41,42.39 39.58,42.57 39.83,42.57 40,42.39 40.26,42.39 40.43,42.57 40.78,42.57 40.95,42.39 41.23,42.39 41.41,42.57 41.68,42.57 41.86,42.39 42.12,42.39 42.3,42.56 42.57,42.56 42.74,42.39 42.96,42.39 43.13,42.56 43.43,42.56 43.6,42.39 43.89,42.39 44.06,42.57 44.35,42.57 44.52,42.4 44.77,42.4 44.95,42.57 45.25,42.57 45.42,42.39 45.7,42.39 45.88,42.57 46.17,42.57 46.35,42.39 46.68,42.39 46.85,42.56 47.14,42.56 47.32,42.39 48.8,42.39 50.22,40.97 50.74,40.97 v50.89,41.12
  Bottom 0.203: 51.01,42.69 B1.BB_40 51,41.24 v50.89,41.12
CLK2_P  (via drill 0.3)
  Top 0.203: HDMI_IN/OUT.10 9.16,33.93 10.2,33.93 10.5,34.24 12.66,34.24 12.87,34.03 U2.16 14.92,34.03 15.02,34.14 16.41,34.14 17.96,32.59 17.96,28.28 18.51,27.73 21.92,27.73 30.35,36.16 33.3,36.16 39.12,41.98 48.63,41.98 50.12,40.49 51.21,40.49 v51.31,40.4
  Bottom 0.203: B1.BB_39 51.52,42.67 51.51,42.66 51.51,40.64 51.29,40.42 v51.31,40.4
CTHPD1  (via drill 0.3)
  Top 0.203: U1.12 19.81,12.82 27.79,12.82 v28.83,11.79
  Bottom 0.203: v28.83,11.79 28,10.96 B1.CB_43
CTHPD2  (via drill 0.3)
  Top 0.203: U2.12 19.79,35.98 22.85,39.05 25.46,39.05 27.06,40.65 v27.5,40.65
  Bottom 0.203: v27.5,40.65 B1.AB_36
D01_N  (via drill 0.3)
  Top 0.203: HDMI_OUT.9 9.16,10.03 10.25,10.03 10.41,9.87 12.91,9.87 13.18,10.14 U1.17 15.27,10.14 16.28,11.16 16.28,14.52 21.66,19.9 23.15,19.9 23.55,19.5 24.56,19.5 25.01,19.95 27.61,19.95 28.04,19.52 28.53,19.52 29.01,20 32.27,20 35.46,23.19 37.92,23.19 38.54,23.81 38.54,26.2 39.17,26.82 40.56,26.82 41.31,26.07 41.99,26.07 42.49,26.58 42.49,27.31 41.59,28.21 41.59,29.04 42.46,29.91 43.72,29.91 44.42,29.21 44.78,29.21 55.56,39.98 55.56,40.68 55.35,40.88 v55.35,41.14
  Bottom 0.203: B1.BB_31 55.5,41.41 55.35,41.27 v55.35,41.14
D01_P  (via drill 0.3)
  Top 0.203: HDMI_OUT.7 9.17,9.07 10.21,9.07 10.6,9.46 13.1,9.46 13.18,9.54 | v56.17,41.1 56.17,40.88 55.98,40.69 55.98,39.83 44.95,28.8 44.25,28.8 43.55,29.5 42.63,29.5 42,28.87 42,28.38 42.93,27.45 42.93,26.43 42.16,25.67 41.14,25.67 40.4,26.4 39.33,26.4 38.95,26.03 38.95,23.65 38.09,22.78 35.65,22.78 32.46,19.6 29.18,19.6 28.69,19.11 27.87,19.11 27.44,19.55 25.18,19.55 24.73,19.09 23.38,19.09 22.98,19.49 21.83,19.49 16.69,14.35 16.69,10.97 15.21,9.49 U1.18 14.05,9.54 13.18,9.54 | 13.18,9.54
  Bottom 0.203: B1.BB_30 56,41.48 56.17,41.32 v56.17,41.1
D02_N  (via drill 0.3)
  Top 0.203: HDMI_IN/OUT.9 10.28,33.41 10.53,33.16 12.87,33.16 13.09,33.38 U2.17 14.9,33.38 15.02,33.26 15.89,33.26 17.39,31.77 17.39,26.88 17.74,26.53 19.06,26.53 19.51,26.98 22.5,26.98 23.83,28.31 24.81,28.31 26.12,27 27.07,27 27.57,27.5 27.57,28.19 26.2,29.56 26.2,30.56 27.16,31.52 28.3,31.52 29.76,30.06 30.59,30.06 31.39,30.87 31.39,31.59 29.92,33.06 29.92,34.11 30.92,35.1 34.03,35.1 34.2,35.26 34.2,35.51 34.37,35.68 34.61,35.68 34.79,35.86 34.79,36.11 35.04,36.35 35.28,36.35 35.48,36.55 35.48,36.8 35.67,36.99 35.93,36.99 36.12,37.18 36.12,37.42 36.31,37.62 36.55,37.62 36.7,37.77 36.7,38.01 36.92,38.23 37.16,38.23 37.36,38.43 37.36,38.68 37.57,38.88 37.81,38.88 37.99,39.06 37.99,39.3 38.2,39.52 38.45,39.52 38.65,39.72 38.65,39.96 38.86,40.17 39.1,40.17 39.34,40.4 39.34,40.65 39.54,40.85 39.78,40.85 39.98,41.04 39.98,41.05 43.32,41.05 v43.52,41.25
  Bottom 0.203: v43.52,41.25 43.66,41.25 43.67,41.26 46.14,41.26 46.5,41.62 B1.BB_49
D02_P  (via drill 0.3)
  Top 0.203: HDMI_IN/OUT.7 10.18,32.41 10.53,32.75 13.89,32.75 U2.18 14.9,32.73 15.02,32.86 15.72,32.86 16.98,31.6 16.98,26.71 17.57,26.12 19.23,26.12 19.68,26.57 22.66,26.57 24,27.9 24.64,27.9 25.95,26.59 27.24,26.59 28,27.36 28,28.34 26.61,29.74 26.61,30.4 27.33,31.11 28.14,31.11 29.6,29.65 30.75,29.65 31.8,30.7 31.8,31.76 30.33,33.23 30.33,33.94 31.07,34.68 34.19,34.68 40.15,40.64 43.2,40.64 43.45,40.4 v43.56,40.4
  Bottom 0.203: B1.BB_48 47,41.49 46.35,40.84 44.07,40.84 43.62,40.4 v43.56,40.4
D11_N  (via drill 0.3)
  Top 0.203: HDMI_OUT.6 9.16,8.53 10.19,8.53 10.48,8.24 14.05,8.24 U1.20 15.34,8.19 17.2,10.05 17.2,13.86 21.73,18.39 22.77,18.39 23.29,17.86 23.29,16.43 23.58,16.14 24.82,16.14 25.16,16.48 25.16,17.85 25.75,18.44 27.29,18.44 27.88,17.85 27.88,16.54 28.3,16.12 28.91,16.12 29.34,16.54 29.34,17.81 29.96,18.44 31.14,18.44 31.77,17.8 31.77,16.75 32.11,16.41 34.18,16.41 35.12,17.34 35.12,18.11 34.33,18.9 34.33,19.93 35.32,20.93 36.41,20.93 37.33,20 38.03,20 38.39,20.36 38.39,20.61 38.56,20.78 38.81,20.78 38.99,20.96 38.99,21.2 39.24,21.45 39.48,21.45 39.68,21.64 39.68,21.9 39.87,22.09 40.12,22.09 40.31,22.28 40.31,22.52 40.51,22.71 40.75,22.71 40.9,22.87 40.9,23.11 41.12,23.32 41.36,23.32 41.56,23.53 41.56,23.77 41.76,23.98 42,23.98 42.18,24.16 42.18,24.4 42.4,24.61 42.65,24.61 54.13,36.1 54.13,36.3 v54.58,36.75 v54.59,36.75
  Bottom 0.203: v54.59,36.75 55.02,36.75 55.5,37.24 B1.BB_20
D11_P  (via drill 0.3)
  Top 0.203: HDMI_OUT.4 9.17,7.57 10.21,7.57 10.46,7.82 12.97,7.82 13.24,7.55 U1.21 15.34,7.54 17.6,9.8 17.6,13.69 21.89,17.98 22.6,17.98 22.89,17.7 22.89,16.26 23.41,15.73 24.99,15.73 25.57,16.31 25.57,17.68 25.92,18.03 27.12,18.03 27.47,17.68 27.47,16.38 28.14,15.71 29.08,15.71 29.74,16.38 29.74,17.64 30.13,18.03 30.97,18.03 31.37,17.63 31.37,16.58 31.95,16 34.35,16 35.52,17.18 35.52,18.28 34.73,19.07 34.73,19.77 35.49,20.52 36.24,20.52 37.16,19.6 38.2,19.6 54.61,36.01 54.68,36.01 v54.73,35.95
  Bottom 0.203: v54.73,35.95 54.83,35.95 56,37.13 B1.BB_21
D12_N  (via drill 0.3)
  Top 0.203: HDMI_IN/OUT.6 9.16,31.9 10.22,31.9 10.52,31.6 12.93,31.6 13.09,31.43 U2.20 14.73,31.43 14.83,31.34 15.4,31.34 16.47,30.26 16.47,24.9 17.35,24.02 18.36,24.02 20.25,25.91 21.59,25.91 22.3,25.2 22.69,25.2 22.88,25.38 23.15,25.38 23.33,25.2 23.6,25.2 23.77,25.37 24.04,25.37 24.21,25.2 24.43,25.2 24.6,25.37 24.9,25.37 25.07,25.2 25.36,25.2 25.54,25.38 25.82,25.38 25.99,25.21 26.25,25.21 26.42,25.38 26.72,25.38 26.89,25.2 27.18,25.2 27.35,25.38 27.65,25.38 27.82,25.2 28.34,25.2 28.77,25.62 28.77,26.86 29.86,27.95 30.69,27.95 30.9,28.16 30.9,28.41 31.11,28.63 31.36,28.63 31.56,28.82 31.56,29.07 31.77,29.28 32.02,29.28 32.25,29.51 32.25,29.76 32.45,29.96 32.7,29.96 32.94,30.21 32.94,32.47 34.02,33.54 36.34,33.54 37.34,34.54 37.34,36.48 38.65,37.8 45.67,37.8 47.95,40.07 47.95,40.38 v47.93,40.41 47.96,40.45
  Bottom 0.203: v47.93,40.41 48.02,40.5 48.02,42.68 B1.BB_46
D12_P  (via drill 0.3)
  Top 0.203: HDMI_IN/OUT.4 9.17,30.94 10.24,30.94 10.5,31.19 12.66,31.19 12.99,30.86 14.21,30.86 | v48.69,40.81 48.69,40.53 48.56,40.41 48.56,40.11 45.84,37.39 38.82,37.39 37.74,36.31 37.74,34.37 36.51,33.13 34.18,33.13 33.35,32.3 33.35,30.04 30.86,27.55 30.03,27.55 29.17,26.69 29.17,25.46 28.51,24.79 22.13,24.79 21.42,25.5 20.42,25.5 18.52,23.61 17.19,23.61 16.07,24.73 16.07,30.07 15.27,30.86 14.21,30.86 | U2.21 14.29,30.79 14.21,30.86
  Bottom 0.203: v48.69,40.81 48.69,41 48.49,41.2 48.49,42.69 B1.BB_45
D21_N  (via drill 0.3)
  Top 0.203: v56.87,40.18 56.87,36.55 41.9,21.58 41.66,21.58 41.46,21.38 41.46,21.14 41.23,20.9 40.98,20.9 40.77,20.7 40.77,20.45 40.58,20.25 40.33,20.25 40.11,20.03 40.11,19.8 39.93,19.61 39.69,19.61 39.49,19.41 39.49,19.16 39.29,18.96 39.05,18.96 38.83,18.75 38.83,18.5 38.68,18.35 38.44,18.35 38.24,18.16 38.24,17.92 38.05,17.73 37.8,17.73 37.61,17.54 37.61,17.28 37.41,17.09 37.17,17.09 36.92,16.84 36.92,16.6 36.74,16.41 36.49,16.41 36.32,16.24 36.32,16 35.31,14.99 19.9,14.99 18.1,13.19 18.1,9.09 15.9,6.89 U1.22 13.21,6.89 13.09,6.77 10.48,6.77 10.24,7.01 9.18,7.01 HDMI_OUT.3
  Bottom 0.203: B1.BB_28 57,41.61 57.02,41.59 57.02,40.54 56.87,40.39 v56.87,40.18
D21_P  (via drill 0.3)
  Top 0.203: v57.68,40.19 57.68,40.01 57.29,39.61 57.29,36.39 35.48,14.58 20.07,14.58 18.5,13.02 18.5,8.9 16.08,6.47 15.16,6.47 14.94,6.24 U1.23 13.23,6.24 13.11,6.37 10.49,6.37 10.49,6.36 10.22,6.09 9.19,6.09 HDMI_OUT.1
  Bottom 0.203: v57.68,40.19 57.68,40.33 57.45,40.56 57.45,41.58 57.5,41.63 B1.BB_27
D22_N  (via drill 0.3)
  Top 0.203: HDMI_IN/OUT.3 9.17,30.39 10.23,30.39 10.5,30.12 13.9,30.12 U2.22 14.77,30.14 15.49,29.41 15.49,20.38 16.19,19.68 17.42,19.68 18.16,20.42 18.16,22.16 19.02,23.01 21.04,23.01 21.68,23.65 22.15,23.65 22.32,23.82 22.63,23.82 22.8,23.65 23.09,23.65 23.26,23.83 23.55,23.83 23.72,23.66 23.97,23.66 24.14,23.83 24.45,23.83 24.62,23.65 26.51,23.65 29.24,23.65 30.15,24.56 30.15,25.57 30.89,26.31 31.95,26.31 32.71,27.07 32.71,27.82 33.37,28.49 34.17,28.49 34.89,29.2 34.89,31.16 35.82,32.09 36.91,32.09 37.35,31.66 38.04,31.66 39.72,33.34 39.72,35.6 40.44,36.32 46.34,36.32 46.65,36.63 v47.33,36.63
  Bottom 0.203: v47.33,36.63 47.62,36.63 47.98,36.98 47.98,38.28 B1.BB_5
D22_P  (via drill 0.3)  (1 unrouted)
  Top 0.203: HDMI_IN/OUT.1 9.17,29.44 10.22,29.44 10.5,29.72 12.88,29.72 13.04,29.55 13.91,29.55 | v46.81,35.92 40.62,35.92 40.13,35.43 40.13,33.17 38.21,31.25 37.18,31.25 36.75,31.69 35.99,31.69 35.29,30.99 35.29,29.04 34.34,28.08 33.54,28.08 33.12,27.65 33.12,26.9 32.12,25.91 31.06,25.91 30.56,25.41 30.56,24.39 29.41,23.24 21.84,23.24 21.2,22.61 19.18,22.61 18.57,21.99 18.57,20.25 17.58,19.27 16.03,19.27 15.09,20.21 15.09,29.23 14.83,29.48 U2.23
  Bottom 0.203: v46.81,35.92 47.49,35.92 48.5,36.93 B1.BB_6
GND  (via drill 0.3)  (8 unrouted)
  Top 0.203: HDMI_OUT.11 v6.42,11.04 | HDMI_OUT.8 6.38,9.54 v6.37,9.56 | HDMI_OUT.5 6.43,8.04 v6.34,8.13 | 6.37,6.54 v6.34,6.57 9.12,6.57 HDMI_OUT.2 | HDMI_IN/OUT.2 9.12,29.89 v6.34,29.89 | HDMI_IN/OUT.5 9.12,31.39 v6.34,31.39 | HDMI_IN/OUT.8 6.38,32.91 v6.34,32.87 | CAMERA2.6 57.91,20.57 TP_GND.TP | FLASH.1 43.98,14.34 v43.28,13.64 | U1.6 21.11,8.84 v21.19,8.93 | v12.7,8.85 v12.71,8.86 14.08,8.86 U1.19 | HDMI_OUT.17 9.13,14.03 v6.34,14.03 | v15.25,32.07 15.23,32.09 U2.19 | U2.14 13.92,35.32 15.27,35.32 v15.28,35.31 | U1.14 13.05,12.09 v12.46,12.69 | 15.63,38.84 15.62,38.85 | 15.62,38.85 15.42,39.05 15.32,39.05 v15.29,39.03 | 15.62,38.85 15.73,38.96 15.84,38.96 v15.94,39.06 | HDMI_IN/OUT.11 6.34,34.41 v6.33,34.4 | C3.2 17.65,41.92 v17.61,41.95
  Top 0.254: HDMI_IN/OUT.17 10.76,37.41 v11.01,37.67 | C12.2 15.63,38.84 | U2.6 20.42,32.09 v20.9,32.56
  Top 0.305: C11.2 12.71,17.03 v12.7,17.04 | C11.2 v11.67,15.93 v11.66,15.93 | C11.2 13.72,15.93 v13.73,15.91 | C4.2 12.42,2.78 v13.41,2.78 | C4.2 11.33,2.94 v11.24,2.85 | C4.2 12.28,2.92 v12.28,1.87
  Top 0.406: C5.2 v11.05,26.28 | C5.2 13.08,26.28 v13.13,26.33 | C5.2 12.08,25.15 v12.06,25.13 | v24.41,10.25 24.38,10.22 23.36,10.22 C2.2 v23.34,9.13
  Top 0.813: C10.2 v1.83,23.88 | C9.2 v1.78,21.59 | R30.2 v9.45,23.88 | R29.2 v9.45,21.61
  Route2 0.813: v1.83,23.88 1.98,23.88
  Bottom 0.203: R22.1 40.39,30.23 41.43,29.18 43,29.18 43.97,28.22 48.36,28.22 49.02,28.88 56.01,28.88 v56.31,29.18 | R21.1 40.46,28.07 41.04,27.48 41.03,27.48 41.64,26.87 43.61,26.87 44.84,25.65 48.83,25.65 49.83,26.64 53.29,26.64 v53.51,26.42 | R20.1 40.4,25.91 41.59,24.71 43.21,24.71 44.84,23.09 47.72,23.09 48.18,22.62 v49.97,22.62 | R19.1 43.96,20.09 47.7,20.09 v47.83,20.22 | R26.1 41.44,15.62 43.54,15.62 v43.56,15.65 | R25.1 40.49,14.48 41.38,13.59 43.23,13.59 v43.28,13.64 | R24.1 40.45,12.32 41.32,11.45 42.7,11.45 42.78,11.53 v43.51,11.53 | R23.1 40.3,10.02 41.04,9.27 43.28,9.27 v43.48,9.47 | B1.CB_4 v26,3.9 B1.CB_47 | B1.CB_10 29,3.83 | 29,3.83 29.01,3.83 B1.CB_41 | 29,3.83 v28.98,3.83 | B1.CB_16 32,4.45 | 32,4.45 v31.98,4.47 | B1.CB_35 32,4.45 | B1.CB_29 v35,4.47 B1.CB_22 | B1.BB_47 47.5,41.11 v47.25,40.87 | B1.BB_4 47.5,39.38 46.79,40.09 v46.79,40.21 | B1.BB_10 v50.5,39.81 | v50.5,39.81 v50.49,39.81 | B1.DB_4 v47.5,4.52 B1.DB_47 | B1.DB_41 50.5,4.54 v50.52,4.52 50.52,2.32 B1.DB_10 | B1.DB_35 v53.5,4.55 v53.49,4.55 B1.DB_16 | B1.DB_22 56.5,4.54 v56.49,4.55 B1.DB_29 | B1.BB_41 50.5,41.63 50.22,41.35 50.22,40.24 50.5,39.95 v50.5,39.81 | B1.BB_35 53.5,41.63 52.93,41.06 v52.91,41.05 52.91,40.28 53.52,39.67 53.52,38.32 B1.BB_16 | B1.AB_29 v31,40.5 v30.99,40.49 30.99,38.31 B1.AB_22 | 23.14,22.65 23.11,22.68 v13.03,22.68 | 12.28,22.68 v12.26,22.66
  Bottom 0.305: v34.68,10.11 35.69,10.11 U$1.4 35.73,9.48 v34.67,9.48
  Bottom 0.406: C1.2 23.15,22.68 13.69,22.68 v13.03,22.68 12.28,22.68 | 23.14,22.65 23.85,21.94 23.85,21.9 24.63,21.12 29.1,21.12 30.5,19.71 31.13,19.71 SI514.P$3
  pour Route2: 3.62,45.81 0.91,43.1 0.91,2.13 3.81,-0.76 63.88,-0.76 66.04,1.4 66.04,43.69 63.92,45.81
HP1  (via drill 0.3)
  Top 0.203: HDMI_OUT.19 10.73,15.04 v10.86,15.18 | U1.10 21.98,11.44 v22.29,11.14
  Bottom 0.203: v10.86,15.18 18.25,15.18 v22.29,11.14
HP1_FPGA  (via drill 0.3)
  Top 0.203: U1.4 25.27,7.54 v25.98,8.25
  Bottom 0.203: v25.98,8.25 25.5,7.77 B1.CB_48
HP2
  Top 0.203: R28.2 14.96,42.73
  Top 0.254: HDMI_IN/OUT.19 9.14,39.72 12.15,42.73 14.96,42.73 15.88,42.73 16.65,41.95 16.65,36.51 18.48,34.69 U2.10
HP2_FPGA  (via drill 0.3)
  Top 0.254: U2.4 19.59,30.83 20.91,30.83 v21.59,31.5
  Route15 0.254: v22.17,40.54 21.62,39.98 21.62,31.53 v21.59,31.5
  Bottom 0.203: 21.5,41.21 B1.AB_48
  Bottom 0.254: v22.17,40.54 21.5,41.21
LINE_1_1
  Bottom 0.203: R4.1 48.13,30.18 R14.1 46.58,30.39 42.16,30.39 R22.2 37.2,35.03 33.81,35.03 32,36.83 B1.AB_24
LINE_1_2
  Bottom 0.203: R3.1 48.68,27.94 47.67,26.93 R13.1 47.46,26.93 46.59,27.79 42.27,27.79 R21.2 41.8,28.07 40.78,29.08 39.42,29.08 38.71,29.79 38.71,32.16 36.8,34.06 32.97,34.06 30.5,36.53 B1.AB_21
LINE_1_3
  Bottom 0.203: R2.1 50.51,25.58 49.36,25.58 48.16,24.37 R12.1 47.19,24.37 46.34,25.23 43.37,25.23 42.69,25.91 R20.2 40.88,27.03 39.24,27.03 37.9,28.37 37.9,31.52 36.22,33.2 32.38,33.2 29,36.58 B1.AB_18
LINE_1_4
  Bottom 0.203: R1.1 50.71,22.44 50.07,21.79 R11.1 47.4,21.79 46.53,22.66 43.09,22.66 R19.2 41.81,23.75 40.74,24.82 39.19,24.82 36.88,27.13 36.88,30.81 35.56,32.13 31.8,32.13 27.5,36.43 B1.AB_15
LINE_2_1
  Bottom 0.203: R10.1 48.35,16.76 R18.1 46.57,16.76 R26.2 35.51,23.25 35.51,27.08 26,36.59 B1.AB_12
LINE_2_2
  Bottom 0.203: R9.1 48.35,14.61 48.02,14.28 R17.1 46.59,14.58 42.1,14.58 R25.2 41.06,15.42 39.8,15.42 38.53,16.69 38.53,18.92 34.7,22.76 34.7,26.62 24.5,36.82 B1.AB_9
LINE_2_3
  Bottom 0.203: R8.1 48.22,12.32 R16.1 46.6,12.42 42.1,12.42 R24.2 40.88,13.44 39.8,13.44 37.77,15.47 37.77,18.14 33.83,22.07 33.83,26.49 23.75,36.58 23.42,36.58 23,36.99 B1.AB_6
LINE_2_4
  Bottom 0.203: R7.1 48.22,10.16 R15.1 46.58,10.28 42.12,10.28 R23.2 40.85,11.3 39.7,11.3 38.94,12.06 38.94,13.31 37.11,15.14 37.11,17.27 33.15,21.23 33.15,26.42 23.57,36 22.65,36 21.5,37.15 B1.AB_3
LSOE1  (via drill 0.3)
  Top 0.203: U1.5 25.04,8.19 25.72,8.87 28.91,8.87 29.57,8.22 v29.59,8.22
  Bottom 0.203: v29.59,8.22 30.68,8.22 31.01,7.89 31.01,6.71 B1.CB_37
LSOE2  (via drill 0.3)
  Top 0.203: U2.5 20.66,31.44 21.55,32.34 21.55,32.57 22.26,33.28
  Top 0.254: v23.78,33.03 23.15,33.03 22.91,33.28 22.26,33.28
  Route15 0.203: v23.78,33.03 23.81,33.03 25.9,35.12
  Route15 0.254: v25.98,40.74 25.9,40.66 25.9,35.12
  Bottom 0.203: v25.98,40.74 25.98,42.68 B1.AB_39
N$1
  cutout Route2: 8.2,29.55 10.07,29.55 10.07,29.27 8.2,29.27
  cutout Route2: 8.2,30.54 10.08,30.54 10.08,30.28 8.2,30.28
  cutout Route2: 8.2,31.05 10.08,31.05 10.08,30.77 8.2,30.77
  cutout Route2: 8.2,32.04 10.08,32.04 10.08,31.78 8.2,31.78
  cutout Route2: 8.2,32.55 10.08,32.55 10.08,32.28 8.2,32.28
  cutout Route2: 8.2,33.55 10.08,33.55 10.08,33.27 8.2,33.27
  cutout Route2: 8.2,34.05 10.08,34.05 10.08,33.78 8.2,33.78
  cutout Route2: 8.2,35.05 10.08,35.05 10.08,34.77 8.2,34.77
  cutout Route2: 8.2,6.18 10.08,6.18 10.08,5.91 8.2,5.91
  cutout Route2: 8.2,7.18 10.08,7.18 10.08,6.91 8.2,6.91
  cutout Route2: 8.2,7.68 10.08,7.68 10.08,7.41 8.2,7.41
  cutout Route2: 8.2,8.68 10.08,8.68 10.08,8.41 8.2,8.41
  cutout Route2: 8.21,9.18 10.09,9.18 10.09,8.91 8.21,8.91
  cutout Route2: 8.2,10.18 10.08,10.18 10.08,9.91 8.2,9.91
  cutout Route2: 8.2,10.68 10.08,10.68 10.08,10.41 8.2,10.41
  cutout Route2: 8.2,11.68 10.08,11.68 10.08,11.41 8.2,11.41
N$2
  Top 0.203: SJ1.1 14.91,40.03 R28.1
N$3
  Top 0.203: CAMERA2.1 58.16,10.16 4.TP
  Bottom 0.203: CAMERA2.1 58.16,10.16 R7.2
N$4
  Top 0.203: CAMERA2.2 58.04,12.45 3.TP
  Bottom 0.203: CAMERA2.2 52.62,12.24 R8.2
N$5
  Top 0.203: CAMERA2.3 57.75,14.73 2.TP
  Bottom 0.203: CAMERA2.3 52.9,14.24 R9.2
N$6
  Top 0.203: CAMERA2.4 57.59,16.89 1.TP
  Bottom 0.203: CAMERA2.4 53.06,16.24 R10.2
N$7
  Top 0.203: CAMERA1.1 57.09,23.62 LINE_1_4.TP
  Bottom 0.203: R1.2 53.48,24.69 CAMERA1.1
N$8
  Top 0.203: CAMERA1.2 57.25,25.78 LINE_1_3.TP
  Bottom 0.203: CAMERA1.2 57.5,26.69 56.58,25.78 R2.2
N$9
  Top 0.203: CAMERA1.3 57.41,27.94 LINE_1_2.TP
  Bottom 0.203: CAMERA1.3 57.71,28.23 52.71,28.23 R3.2
N$10
  Top 0.203: CAMERA1.4 57.57,30.1 LINE_1_1.TP
  Bottom 0.203: CAMERA1.4 52.94,30.69 R4.2
N$13  (2 unrouted)
  Top 0.813: HDMI_OUT.P3 4.65,18.64 | 4.65,18.64 7.54,18.64 HDMI_OUT.P2 | R29.1 6.54,21.59 C9.1 4.66,18.66 4.65,18.64
N$14  (2 unrouted)
  Top 0.813: HDMI_IN/OUT.P4 6.91,26.31 | 6.91,26.31 7.54,26.31 HDMI_IN/OUT.P1 | 6.91,26.31 6.64,26.05 R30.1 C10.1
N$17
  Bottom 0.203: 52.32,30.12 52.3,30.1 50.88,30.1
N$18
  Bottom 0.203: 52.25,27.86 50.9,27.86 50.83,27.94
N$19
  Bottom 0.203: 52.27,25.76 52.22,25.7 50.85,25.7
N$20
  Bottom 0.203: 52.32,23.47 51.03,23.47 50.83,23.67
N$21
  Bottom 0.203: 52.48,16.79 51.1,16.79 51,16.69
N$22
  Bottom 0.203: 52.5,14.53 50.9,14.53 50.85,14.58
N$23
  Bottom 0.203: 52.32,12.32 52.27,12.27 50.88,12.27
N$24
  Bottom 0.203: 52.58,10.13 50.93,10.13 50.88,10.08
OSC_CLK
  Bottom 0.203: SI514.P$4 27,19.78 B1.CB_45 | B1.CB_45
OSC_SCL  (via drill 0.3)
  Top 0.203: v19.77,37.12 19.79,37.14 20.22,37.14 21.44,38.36 21.44,41.33 22.09,41.99 29.32,41.99 v30.13,41.18
  Bottom 0.203: SI514.P$2 32.59,23.71 32.59,25.91 28.78,29.72 R27.1 26.48,30.35 26.12,30.71 26.12,32.65 23.32,35.46 21.48,35.46 19.81,37.12 v19.77,37.12 | v30.13,41.18 30,41.31 B1.AB_31
OSC_SDA  (via drill 0.3)
  Top 0.203: v18.62,37.68 18.68,37.73 20.2,37.73 20.93,38.46 20.93,41.59 21.76,42.42 30.22,42.42 v31.62,41.02
  Bottom 0.203: SI514.P$1 31.23,26.22 29.54,27.91 R6.1 26.45,28.13 25.59,28.99 25.59,32.52 23.34,34.77 21.24,34.77 18.48,37.54 v18.62,37.68 | v31.62,41.02 31.5,41.14 B1.AB_28
SCL1  (via drill 0.3)
  Top 0.203: HDMI_OUT.15 11.63,13.04 v11.76,13.17 | v22.24,9.21 21.3,10.14 U1.8
  Bottom 0.203: v11.76,13.17 11.76,12.5 15.95,8.31 21.67,8.31 22.24,8.88 v22.24,9.21
SCL1_FPGA  (via drill 0.3)
  Top 0.203: U1.2 20.73,6.24 22.4,4.57 29.27,4.57 29.72,5.03 v29.74,5.03
  Bottom 0.203: v29.74,5.03 30,5.29 B1.CB_39
SCL2  (via drill 0.3)
  Top 0.254: U2.8 v20.95,33.38 v20.95,33.4 | v12.59,36.61 12.24,36.61 12.04,36.41 HDMI_IN/OUT.15
  Bottom 0.254: v12.59,36.61 12.62,36.65 17.77,36.65 20.95,33.47 v20.95,33.4
SCL2_FPGA  (via drill 0.3)
  Top 0.254: U2.2 21.14,29.48 23.1,31.45 v23.1,32.37
  Route15 0.254: v24.5,40.13 22.69,38.32 22.69,32.78 v23.1,32.37
  Bottom 0.203: v24.5,40.13 B1.AB_42
SDA1  (via drill 0.3)
  Top 0.203: HDMI_OUT.16 10.29,13.54 10.37,13.46 10.86,13.46 v11.31,13.91 | v22.3,10.02 21.53,10.79 U1.9
  Bottom 0.203: v11.31,13.91 v11.32,13.9 12.12,13.9 16,10.02 v22.3,10.02
SDA1_FPGA  (via drill 0.3)
  Top 0.203: U1.3 20.79,6.89 22.59,5.09 28.28,5.09 v28.38,5.19
  Bottom 0.203: v28.38,5.19 28.4,5.19 28.5,5.29 B1.CB_42
SDA2  (via drill 0.3)
  Top 0.254: U2.9 23.19,34.03 v23.44,33.78 | v11.99,37.29 11.61,36.91 HDMI_IN/OUT.16
  Bottom 0.254: v11.99,37.29 18.03,37.29 21.29,34.04 23.19,34.04 v23.44,33.78
SDA2_FPGA  (via drill 0.3)
  Top 0.254: U2.3 21.12,30.14 22.28,31.29 v22.28,32.26
  Route15 0.254: v22.28,32.26 22.23,32.26 22.23,39.2 v23,39.97
  Bottom 0.203: v23,39.97 B1.AB_45
  Bottom 0.254: B1.AB_45
SPI_CLK  (via drill 0.3)
  Top 0.203: FLASH.2 45.44,14.29 45.44,9.08 45.19,8.84 32.59,8.84 31.68,8.84 v31.5,8.66
  Bottom 0.203: U$1.6 29.77,11.05 29.39,10.67 29.39,9.37 29.92,8.84 31.34,8.84 31.5,8.68 v31.5,8.66 B1.CB_36
SPI_CS  (via drill 0.3)
  Top 0.203: FLASH.5 49.23,13.7 47.09,11.56 47.09,8.23 46,7.14 37.86,7.14 v35.88,5.16
  Bottom 0.203: R5.1 36.02,13.97 U$1.1 37.36,13.59 38.3,12.65 38.3,8.91 37.8,8.41 36.6,8.41 36,7.81 B1.CB_27 36,5.28 v35.88,5.16
SPI_DI  (via drill 0.3)  (1 unrouted)
  Top 0.203: FLASH.3 46.73,12.7 46,11.96 46,8.88 45.54,8.43 33.12,8.43 32.91,8.22 v32.88,8.22
  Bottom 0.203: U$1.5 31.93,9.78 32.88,8.83 v32.88,8.22 33,8.1 B1.CB_33 | 33,6.82 32.99,6.83
SPI_DO  (via drill 0.3)
  Top 0.203: FLASH.4 47.98,13.16 46.53,11.71 46.53,8.51 45.72,7.7 36.94,7.7 v34.38,5.14
  Bottom 0.203: U$1.2 37.26,12.32 37.69,11.89 37.69,9.45 37.24,8.99 35.28,8.99 34.52,8.23 34.52,6.72 | 34.52,6.72 B1.CB_30 | v34.38,5.14 v34.38,5.15 34.52,5.29 34.52,6.72

### Text on the board
tNames: Alchitry AU+AR Shield / v1.2 | Matt Ruffner / Dr. Daniel L. Lau / Ying Yu / University of Kentucky 2019 | 1 | 2 | 3 | 4 | GND | GND / CLK / MOSI / MISO / CS | Short SJ1 to enable HDMI output
bNames: Pull / Down | Series / 0 Ohm / Until / Cut | 3.3V / Pull / Up | LINE_1_1 | LINE_1_2 | LINE_1_3 | LINE_1_4 | LINE_2_1 | LINE_2_2 | LINE_2_3 | LINE_2_4